# EAGLE design Allwinner V3s Dev-board (EAGLE 7.7.0)
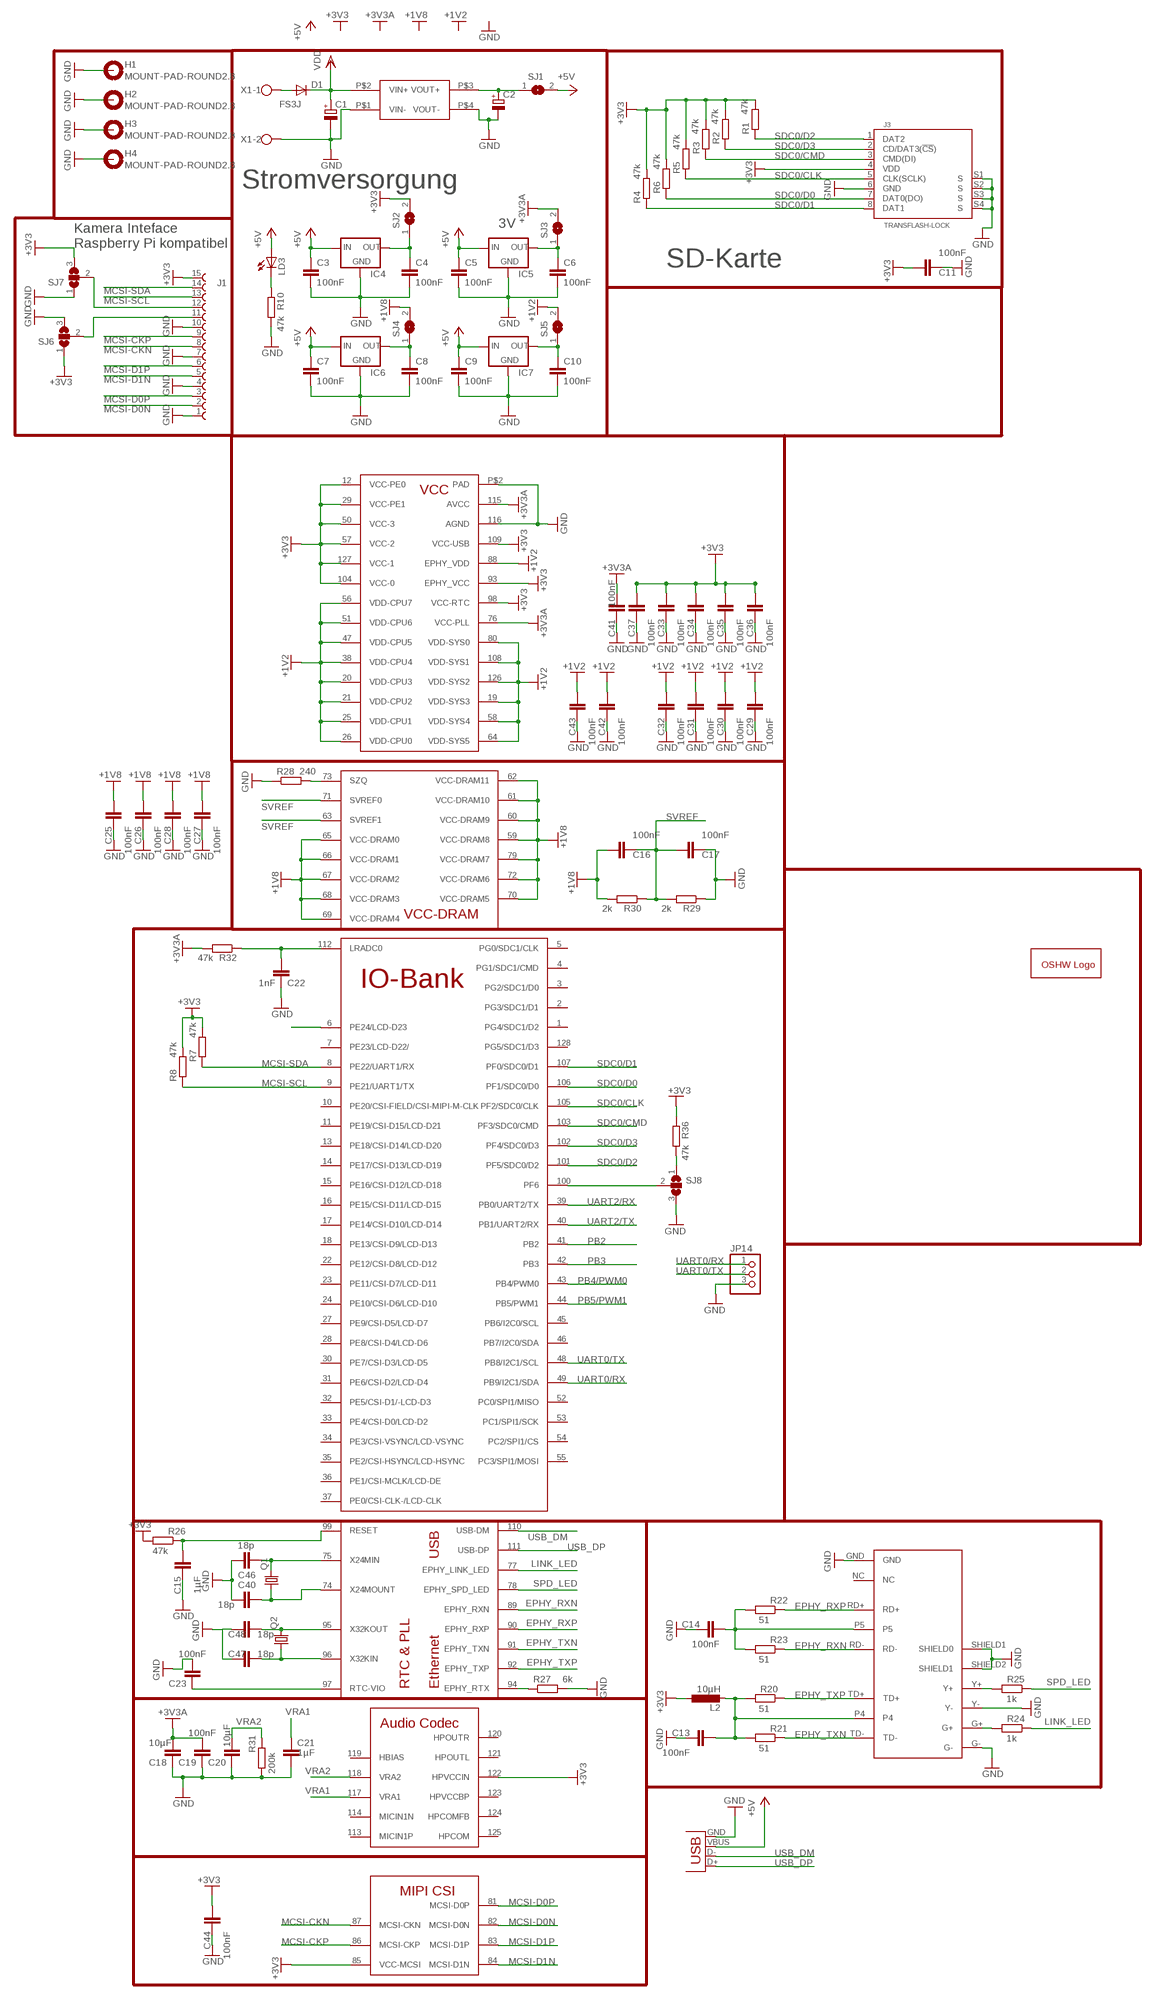
[diagram p0: schematic, sheet 1, part 1 of 2]
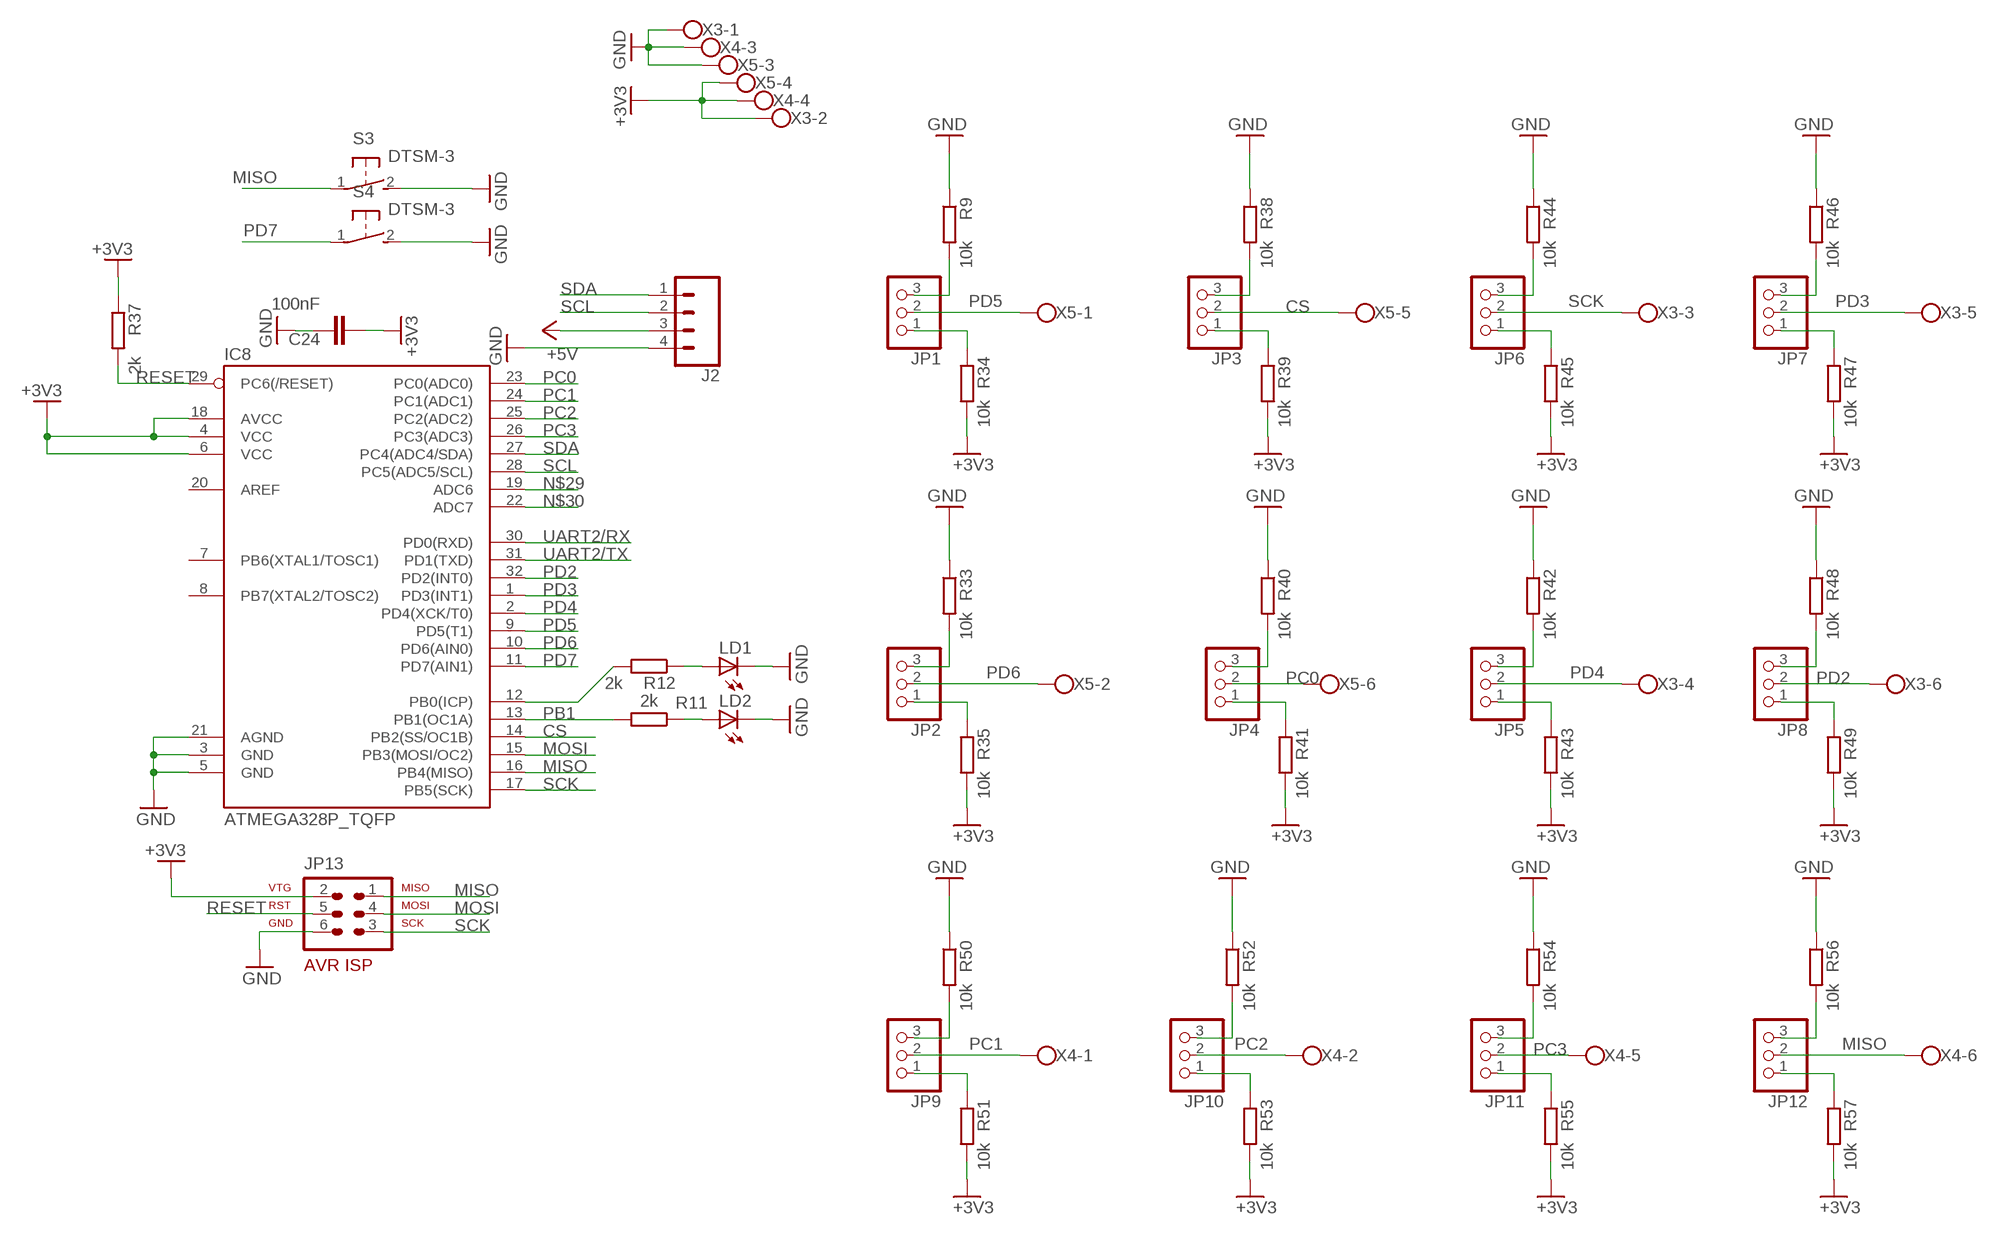
[diagram p1: schematic, sheet 1, part 2 of 2]

## Parts
C1  CPOL-EU153CLV-0807  [153CLV-0807]
C2  CPOL-EU153CLV-0807  [153CLV-0807]
C3  100nF  C-EUC0805  [C0805]
C4  100nF  C-EUC0805  [C0805]
C5  100nF  C-EUC0805  [C0805]
C6  100nF  C-EUC0805  [C0805]
C7  100nF  C-EUC0805  [C0805]
C8  100nF  C-EUC0805  [C0805]
C9  100nF  C-EUC0805  [C0805]
C10  100nF  C-EUC0805  [C0805]
C11  100nF  C-EUC0805  [C0805]
C13  100nF  C-EUC0805  [C0805]
C14  100nF  C-EUC0805  [C0805]
C15  1µF  C-EUC0805  [C0805]
C16  100nF  C-EUC0805  [C0805]
C17  100nF  C-EUC0805  [C0805]
C18  10µF  C-EUC0805  [C0805]
C19  100nF  C-EUC0805  [C0805]
C20  10µF  C-EUC0805  [C0805]
C21  1µF  C-EUC0805  [C0805]
C22  1nF  C-EUC0805  [C0805]
C23  100nF  C-EUC0805  [C0805]
C24  100nF  C-EUC0805  [C0805]
C25  100nF  C-EUC0805  [C0805]
C26  100nF  C-EUC0805  [C0805]
C27  100nF  C-EUC0805  [C0805]
C28  100nF  C-EUC0805  [C0805]
C29  100nF  C-EUC0805  [C0805]
C30  100nF  C-EUC0805  [C0805]
C31  100nF  C-EUC0805  [C0805]
C32  100nF  C-EUC0805  [C0805]
C33  100nF  C-EUC0805  [C0805]
C34  100nF  C-EUC0805  [C0805]
C35  100nF  C-EUC0805  [C0805]
C36  100nF  C-EUC0805  [C0805]
C37  100nF  C-EUC0805  [C0805]
C40  18p  C-EUC0805  [C0805]
C41  100nF  C-EUC0805  [C0805]
C42  100nF  C-EUC0805  [C0805]
C43  100nF  C-EUC0805  [C0805]
C44  100nF  C-EUC0805  [C0805]
C46  18p  C-EUC0805  [C0805]
C47  18p  C-EUC0805  [C0805]
C48  18p  C-EUC0805  [C0805]
D1  FS3J  DIODE-SMC  [SMC]
GOLD_ORB_SM2  OSHWLOGOLOGO8MM  [OSHW_8MM]
H1  MOUNT-PAD-ROUND2.8  [2,8-PAD]
H2  MOUNT-PAD-ROUND2.8  [2,8-PAD]
H3  MOUNT-PAD-ROUND2.8  [2,8-PAD]
H4  MOUNT-PAD-ROUND2.8  [2,8-PAD]
IC1  V3S  [QFP-128]
IC4  LM1117  [SOT223]
IC5  LM1117  [SOT223]
IC6  LM1117  [SOT223]
IC7  LM1117  [SOT223]
IC8  ATMEGA328P_TQFP  [TQFP32-08]
J1  68611514122  [68611514122]
J2  CONN_04SMD_LONG  [1X04_SMD_LONG]
J3  TRANSFLASH-LOCK  [TRANSFLASH-LOCK-SOCK]
JP1  PINHD-1X3  [1X03]
JP2  PINHD-1X3  [1X03]
JP3  PINHD-1X3  [1X03]
JP4  PINHD-1X3  [1X03]
JP5  PINHD-1X3  [1X03]
JP6  PINHD-1X3  [1X03]
JP7  PINHD-1X3  [1X03]
JP8  PINHD-1X3  [1X03]
JP9  PINHD-1X3  [1X03]
JP10  PINHD-1X3  [1X03]
JP11  PINHD-1X3  [1X03]
JP12  PINHD-1X3  [1X03]
JP13  AVR-ISP-6  [AVR-ISP-6]
JP14  PINHD-1X3  [1X03]
L2  10µH  L-EUL0805  [L0805]
LD1  LEDSMT1206  [1206]
LD2  LEDSMT1206  [1206]
LD3  LEDSMT1206  [1206]
M1  MP1584-MINI  [MINI-DC-BRICK]
Q1  CRYSTALHC49S  [HC49/S]
Q2  CRYSTALTC26H  [TC26H]
R1  47k  R-EU_R0805  [R0805]
R2  47k  R-EU_R0805  [R0805]
R3  47k  R-EU_R0805  [R0805]
R4  47k  R-EU_R0805  [R0805]
R5  47k  R-EU_R0805  [R0805]
R6  47k  R-EU_R0805  [R0805]
R7  47k  R-EU_R0805  [R0805]
R8  47k  R-EU_R0805  [R0805]
R9  10k  R-EU_R0805  [R0805]
R10  47k  R-EU_R0805  [R0805]
R11  2k  R-EU_R0805  [R0805]
R12  2k  R-EU_R0805  [R0805]
R20  51  R-EU_R0805  [R0805]
R21  51  R-EU_R0805  [R0805]
R22  51  R-EU_R0805  [R0805]
R23  51  R-EU_R0805  [R0805]
R24  1k  R-EU_R0805  [R0805]
R25  1k  R-EU_R0805  [R0805]
R26  47k  R-EU_R0805  [R0805]
R27  6k  R-EU_R0805  [R0805]
R28  240  R-EU_R0805  [R0805]
R29  2k  R-EU_R0805  [R0805]
R30  2k  R-EU_R0805  [R0805]
R31  200k  R-EU_R0805  [R0805]
R32  47k  R-EU_R0805  [R0805]
R33  10k  R-EU_R0805  [R0805]
R34  10k  R-EU_R0805  [R0805]
R35  10k  R-EU_R0805  [R0805]
R36  47k  R-EU_R0805  [R0805]
R37  2k  R-EU_R0805  [R0805]
R38  10k  R-EU_R0805  [R0805]
R39  10k  R-EU_R0805  [R0805]
R40  10k  R-EU_R0805  [R0805]
R41  10k  R-EU_R0805  [R0805]
R42  10k  R-EU_R0805  [R0805]
R43  10k  R-EU_R0805  [R0805]
R44  10k  R-EU_R0805  [R0805]
R45  10k  R-EU_R0805  [R0805]
R46  10k  R-EU_R0805  [R0805]
R47  10k  R-EU_R0805  [R0805]
R48  10k  R-EU_R0805  [R0805]
R49  10k  R-EU_R0805  [R0805]
R50  10k  R-EU_R0805  [R0805]
R51  10k  R-EU_R0805  [R0805]
R52  10k  R-EU_R0805  [R0805]
R53  10k  R-EU_R0805  [R0805]
R54  10k  R-EU_R0805  [R0805]
R55  10k  R-EU_R0805  [R0805]
R56  10k  R-EU_R0805  [R0805]
R57  10k  R-EU_R0805  [R0805]
S3  DTSM-3  [DTSM-3]
S4  DTSM-3  [DTSM-3]
SJ1  SJ  [SJ]
SJ2  SJ  [SJ]
SJ3  SJ  [SJ]
SJ4  SJ  [SJ]
SJ5  SJ  [SJ]
SJ6  SJ2W  [SJ_2]
SJ7  SJ2W  [SJ_2]
SJ8  SJ2W  [SJ_2]
U$3  HR911105A  [RJ45]
X1  W237-102  [W237-102]
X2  USB-A-H  [USB-A-H]
X3  W237-6  [W237-6]
X4  W237-6  [W237-6]
X5  W237-6  [W237-6]

## Nets
+1V2: C29.1 C30.1 C31.1 C32.1 C42.1 C43.1 IC1.19(VDD-SYS3) IC1.20(VDD-CPU3) IC1.21(VDD-CPU2) IC1.25(VDD-CPU1) IC1.26(VDD-CPU0) IC1.38(VDD-CPU4) IC1.47(VDD-CPU5) IC1.51(VDD-CPU6) IC1.56(VDD-CPU7) IC1.58(VDD-SYS4) IC1.64(VDD-SYS5) IC1.80(VDD-SYS0) IC1.88(EPHY_VDD) IC1.108(VDD-SYS1) IC1.126(VDD-SYS2) SJ5.2
+1V8: C16.1 C25.1 C26.1 C27.1 C28.1 IC1.59(VCC-DRAM8) IC1.60(VCC-DRAM9) IC1.61(VCC-DRAM10) IC1.62(VCC-DRAM11) IC1.65(VCC-DRAM0) IC1.66(VCC-DRAM1) IC1.67(VCC-DRAM2) IC1.68(VCC-DRAM3) IC1.69(VCC-DRAM4) IC1.70(VCC-DRAM5) IC1.72(VCC-DRAM6) IC1.79(VCC-DRAM7) R30.2 SJ4.2
+3V3: C11.1 C24.1 C33.1 C34.1 C35.1 C36.1 C37.1 C44.1 IC1.12(VCC-PE0) IC1.29(VCC-PE1) IC1.50(VCC-3) IC1.57(VCC-2) IC1.85(VCC-MCSI) IC1.93(EPHY_VCC) IC1.98(VCC-RTC) IC1.104(VCC-0) IC1.109(VCC-USB) IC1.122(HPVCCIN) IC1.127(VCC-1) IC8.4(VCC) IC8.6(VCC) IC8.18(AVCC) J1.15 J3.4(VDD) JP13.2 L2.1 R1.2 R2.2 R3.2 R4.2 R5.2 R6.2 R7.2 R8.2 R26.2 R34.2 R35.2 R36.1 R37.1 R39.2 R41.2 R43.2 R45.2 R47.2 R49.2 R51.2 R53.2 R55.2 R57.2 SJ2.2 SJ6.1 SJ7.3 X3.2 X4.4 X5.4
+3V3A: C18.1 C19.1 C41.1 IC1.76(VCC-PLL) IC1.115(AVCC) R32.2 SJ3.2
+5V: C3.1 C5.1 C7.1 C9.1 IC4.3(IN) IC5.3(IN) IC6.3(IN) IC7.3(IN) J2.3 LD3.A SJ1.2 X2.VBUS
CS: IC8.14(PB2(SS/OC1B)) JP3.2 X5.5
EPHY_RXN: IC1.89(EPHY_RXN) R23.1 U$3.RD-
EPHY_RXP: IC1.90(EPHY_RXP) R22.1 U$3.RD+
EPHY_TXN: IC1.91(EPHY_TXN) R21.1 U$3.TD-
EPHY_TXP: IC1.92(EPHY_TXP) R20.1 U$3.TD+
GND: C1.- C2.- C3.2 C4.2 C5.2 C6.2 C7.2 C8.2 C9.2 C10.2 C11.2 C13.2 C14.2 C15.2 C17.2 C18.2 C19.2 C20.2 C21.2 C22.1 C23.1 C24.2 C25.2 C26.2 C27.2 C28.2 C29.2 C30.2 C31.2 C32.2 C33.2 C34.2 C35.2 C36.2 C37.2 C40.1 C41.2 C42.2 C43.2 C44.2 C46.1 C47.1 C48.1 H1.B2,8(MOUNT) H2.B2,8(MOUNT) H3.B2,8(MOUNT) H4.B2,8(MOUNT) IC1.116(AGND) IC1.P$2(PAD) IC4.1(GND) IC5.1(GND) IC6.1(GND) IC7.1(GND) IC8.3(GND) IC8.5(GND) IC8.21(AGND) J1.1 J1.4 J1.7 J1.10 J2.4 J3.6(GND) J3.S1(S) J3.S2(S) J3.S3(S) J3.S4(S) JP13.6 JP14.3 LD1.C LD2.C M1.P$1(VIN-) M1.P$4(VOUT-) R9.1 R10.2 R27.2 R28.1 R29.1 R31.2 R33.1 R38.1 R40.1 R42.1 R44.1 R46.1 R48.1 R50.1 R52.1 R54.1 R56.1 S3.2 S4.2 SJ6.3 SJ7.1 SJ8.3 U$3.G- U$3.GND U$3.SHIELD1(SHIELD0) U$3.SHIELD2(SHIELD1) U$3.Y- X1.2 X2.GND X3.1 X4.3 X5.3
LINK_LED: IC1.77(EPHY_LINK_LED) R24.1
MCSI-CKN: IC1.87(MCSI-CKN) J1.8
MCSI-CKP: IC1.86(MCSI-CKP) J1.9
MCSI-D0N: IC1.82(MCSI-D0N) J1.2
MCSI-D0P: IC1.81(MCSI-D0P) J1.3
MCSI-D1N: IC1.84(MCSI-D1N) J1.5
MCSI-D1P: IC1.83(MCSI-D1P) J1.6
MCSI-SCL: IC1.9(PE21/UART1/TX) J1.13 R8.1
MCSI-SDA: IC1.8(PE22/UART1/RX) J1.14 R7.1
MISO: IC8.16(PB4(MISO)) JP12.2 JP13.1 S3.1 X4.6
MOSI: IC8.15(PB3(MOSI/OC2)) JP13.4
N$1: D1.A X1.1
N$2: JP2.3 R33.2
N$3: JP1.3 R9.2
N$4: C15.1 IC1.99(RESET) R26.1
N$5: LD1.A R12.1
N$6: LD3.C R10.1
N$7: JP1.1 R34.1
N$8: J1.11 SJ6.2
N$9: J1.12 SJ7.2
N$10: IC8.12(PB0(ICP)) R12.2
N$11: JP2.1 R35.1
N$12: JP3.3 R38.2
N$13: JP3.1 R39.1
N$14: JP4.3 R40.2
N$15: C2.+ M1.P$3(VOUT+) SJ1.1
N$16: JP4.1 R41.1
N$17: IC1.94(EPHY_RTX) R27.1
N$18: R24.2 U$3.G+
N$19: IC1.73(SZQ) R28.2
N$20: R25.2 U$3.Y+
N$21: C13.1 L2.2 R20.2 R21.2 U$3.P4
N$22: C14.1 R22.2 R23.2 U$3.P5
N$23: C22.2 IC1.112(LRADC0) R32.1
N$24: C23.2 IC1.97(RTC-VIO)
N$25: IC1.100(PF6) SJ8.2
N$26: IC1.6(PE24/LCD-D23)
N$27: R36.2 SJ8.1
N$28: JP5.3 R42.2
N$29: IC8.19(ADC6)
N$30: IC8.22(ADC7)
N$31: JP5.1 R43.1
N$32: JP6.3 R44.2
N$33: JP6.1 R45.1
N$34: JP7.3 R46.2
N$35: JP7.1 R47.1
N$36: JP8.3 R48.2
N$37: JP8.1 R49.1
N$38: JP9.3 R50.2
N$39: JP9.1 R51.1
N$40: JP10.3 R52.2
N$41: JP10.1 R53.1
N$42: C4.1 IC4.2(OUT) SJ2.1
N$43: C6.1 IC5.2(OUT) SJ3.1
N$44: C8.1 IC6.2(OUT) SJ4.1
N$45: C10.1 IC7.2(OUT) SJ5.1
N$46: C40.2 IC1.74(X24MOUNT) Q1.1
N$47: C46.2 IC1.75(X24MIN) Q1.2
N$48: C47.2 IC1.96(X32KIN) Q2.1
N$49: C48.2 IC1.95(X32KOUT) Q2.2
N$50: JP11.3 R54.2
N$51: JP11.1 R55.1
N$52: JP12.3 R56.2
N$53: JP12.1 R57.1
N$54: LD2.A R11.1
PB1: IC8.13(PB1(OC1A)) R11.2
PB2: IC1.41(PB2)
PB3: IC1.42(PB3)
PB4/PWM0: IC1.43(PB4/PWM0)
PB5/PWM1: IC1.44(PB5/PWM1)
PC0: IC8.23(PC0(ADC0)) JP4.2 X5.6
PC1: IC8.24(PC1(ADC1)) JP9.2 X4.1
PC2: IC8.25(PC2(ADC2)) JP10.2 X4.2
PC3: IC8.26(PC3(ADC3)) JP11.2 X4.5
PD2: IC8.32(PD2(INT0)) JP8.2 X3.6
PD3: IC8.1(PD3(INT1)) JP7.2 X3.5
PD4: IC8.2(PD4(XCK/T0)) JP5.2 X3.4
PD5: IC8.9(PD5(T1)) JP1.2 X5.1
PD6: IC8.10(PD6(AIN0)) JP2.2 X5.2
PD7: IC8.11(PD7(AIN1)) S4.1
RESET: IC8.29(PC6(/RESET)) JP13.5 R37.2
SCK: IC8.17(PB5(SCK)) JP6.2 JP13.3 X3.3
SCL: IC8.28(PC5(ADC5/SCL)) J2.2
SDA: IC8.27(PC4(ADC4/SDA)) J2.1
SDC0/CLK: IC1.105(PF2/SDC0/CLK) J3.5(CLK(SCLK)) R5.1
SDC0/CMD: IC1.103(PF3/SDC0/CMD) J3.3(CMD(DI)) R3.1
SDC0/D0: IC1.106(PF1/SDC0/D0) J3.7(DAT0(DO)) R6.1
SDC0/D1: IC1.107(PF0/SDC0/D1) J3.8(DAT1) R4.1
SDC0/D2: IC1.101(PF5/SDC0/D2) J3.1(DAT2) R1.1
SDC0/D3: IC1.102(PF4/SDC0/D3) J3.2(CD/DAT3(!CS!)) R2.1
SPD_LED: IC1.78(EPHY_SPD_LED) R25.1
SVREF: C16.2 C17.1 IC1.63(SVREF1) IC1.71(SVREF0) R29.2 R30.1
UART0/RX: IC1.49(PB9/I2C1/SDA) JP14.1
UART0/TX: IC1.48(PB8/I2C1/SCL) JP14.2
UART2/RX: IC1.39(PB0/UART2/TX) IC8.30(PD0(RXD))
UART2/TX: IC1.40(PB1/UART2/RX) IC8.31(PD1(TXD))
USB_DM: IC1.110(USB-DM) X2.D-
USB_DP: IC1.111(USB-DP) X2.D+
VDD: C1.+ D1.C M1.P$2(VIN+)
VRA1: C21.1 IC1.117(VRA1)
VRA2: C20.1 IC1.118(VRA2) R31.1
Unconnected: IC1.1(PG4/SDC1/D2) IC1.2(PG3/SDC1/D1) IC1.3(PG2/SDC1/D0) IC1.4(PG1/SDC1/CMD) IC1.5(PG0/SDC1/CLK) IC1.7(PE23/LCD-D22/) IC1.10(PE20/CSI-FIELD/CSI-MIPI-M-CLK) IC1.11(PE19/CSI-D15/LCD-D21) IC1.13(PE18/CSI-D14/LCD-D20) IC1.14(PE17/CSI-D13/LCD-D19) IC1.15(PE16/CSI-D12/LCD-D18) IC1.16(PE15/CSI-D11/LCD-D15) IC1.17(PE14/CSI-D10/LCD-D14) IC1.18(PE13/CSI-D9/LCD-D13) IC1.22(PE12/CSI-D8/LCD-D12) IC1.23(PE11/CSI-D7/LCD-D11) IC1.24(PE10/CSI-D6/LCD-D10) IC1.27(PE9/CSI-D5/LCD-D7) IC1.28(PE8/CSI-D4/LCD-D6) IC1.30(PE7/CSI-D3/LCD-D5) IC1.31(PE6/CSI-D2/LCD-D4) IC1.32(PE5/CSI-D1/-LCD-D3) IC1.33(PE4/CSI-D0/LCD-D2) IC1.34(PE3/CSI-VSYNC/LCD-VSYNC) IC1.35(PE2/CSI-HSYNC/LCD-HSYNC) IC1.36(PE1/CSI-MCLK/LCD-DE) IC1.37(PE0/CSI-CLK-/LCD-CLK) IC1.45(PB6/I2C0/SCL) IC1.46(PB7/I2C0/SDA) IC1.52(PC0/SPI1/MISO) IC1.53(PC1/SPI1/SCK) IC1.54(PC2/SPI1/CS) IC1.55(PC3/SPI1/MOSI) IC1.113(MICIN1P) IC1.114(MICIN1N) IC1.119(HBIAS) IC1.120(HPOUTR) IC1.121(HPOUTL) IC1.123(HPVCCBP) IC1.124(HPCOMFB) IC1.125(HPCOM) IC1.128(PG5/SDC1/D3) IC8.7(PB6(XTAL1/TOSC1)) IC8.8(PB7(XTAL2/TOSC2)) IC8.20(AREF) U$3.NC

## Notes on the sheet
- Stromversorgung
- 3V
- Kamera Inteface 
  Raspberry Pi kompatibel
- SD-Karte

## Library data of the parts
C1 C2 = rcl:CPOL-EU: POLARIZED CAPACITOR, European symbol
C3-C11 C13-C37 C40-C44 C46-C48 = rcl:C-EU: CAPACITOR, European symbol
D1 = diode-1:DIODE-: DIODE
GOLD_ORB_SM2 = oshw:OSHWLOGO: The OSHW logo for PCB layout
H1-H4 = holes:MOUNT-PAD-ROUND: MOUNTING PAD, round
IC1 = Allwinner V3s:V3S
IC4-IC7 = v-reg-2:LM1117
IC8 = SparkFun-IC-Microcontroller:ATMEGA328P_TQFP: Popular 328P in QFP Storefront component: ATmega328 - TQFP <https://www.sparkfun.com/products/13448> (COM-13448) Datasheet <http://www.sparkfun.com/datasheets/Components/SMD/ATMega328.pdf> SparkFun Products SparkFun RedBoard - Programmed with Arduino <https://www.sparkfun.com/products/12757> (DEV-12757) Arduino Pro Mini 328 - 5V/16MHz <https://www.sparkfun.com/products/11113> (DEV-11113) Arduino Pro Mini 328 - 3.3V/8MHz <https://www.sparkfun.com/products/11114> (DEV-11114) SparkFun OpenLog <https://www.sparkfun.com/products/13712> (DEV-13712) SparkFun MicroView - OLED Arduino Module <https://www.sparkfun.com/products/12923> (DEV-12923) SparkFun Digital Sandbox <https://www.sparkfun.com/products/12651> (DEV-12651) SparkFun PicoBoard <https://www.sparkfun.com/products/11888> (WIG-11888) Arduino Fio <https://www.sparkfun.com/products/10116> (DEV-10116) LilyPad Arduino 328 Main Board <https://www.sparkfun.com/products/13342> (DEV-13342) SparkFun RedStick <https://www.sparkfun.com/products/13741> (DEV-13741) LilyPad MP3 <https://www.sparkfun.com/products/11013> (DEV-11013) LilyPad Arduino SimpleSnap <https://www.sparkfun.com/products/10941> (DEV-10941) SparkFun Stepoko <https://www.sparkfun.com/products/13899> (ROB-13899) SparkFun Geiger Counter <https://www.sparkfun.com/products/11345> (SEN-11345) SparkFun EL Sequencer <https://www.sparkfun.com/products/12781> (COM-12781) Arduino Pro 328 - 5V/16MHz <https://www.sparkfun.com/products/10915> (DEV-10915) CryptoCape <https://www.sparkfun.com/products/12773> (DEV-12773) SparkFun IR Thermometer Evaluation Board - MLX90614 <https://www.sparkfun.com/products/10740> (SEN-10740) SparkFun RedBot Mainboard <https://www.sparkfun.com/products/12097> (ROB-12097) Arduino Pro 328 - 3.3V/8MHz <https://www.sparkfun.com/products/10914> (DEV-10914) SparkFun Block for Intel® Edison - Arduino <https://www.sparkfun.com/products/13036> (DEV-13036) SparkFun Simon Says - Surface Mount Soldering Kit <https://www.sparkfun.com/products/10935> (KIT-10935) SparkFun 7-Segment Serial Display - Red <https://www.sparkfun.com/products/11441> (COM-11441) SparkFun 7-Segment Serial Display - White <https://www.sparkfun.com/products/11629> (COM-11629) SparkFun 7-Segment Serial Display - Yellow <https://www.sparkfun.com/products/11443> (COM-11443) SparkFun 7-Segment Serial Display - Kelly Green <https://www.sparkfun.com/products/11440> (COM-11440) SparkFun 7-Segment Serial Display - Blue <https://www.sparkfun.com/products/11442> (COM-11442) SparkFun OpenSegment Serial Display - 20mm (Blue) <https://www.sparkfun.com/products/11647> (COM-11647) SparkFun OpenSegment Serial Display - 20mm (Green) <https://www.sparkfun.com/products/11646> (COM-11646) SparkFun OpenSegment Serial Display - 20mm (White) <https://www.sparkfun.com/products/11648> (COM-11648) SparkFun OpenSegment Serial Display - 20mm (Red) <https://www.sparkfun.com/products/11644> (COM-11644) SparkFun OpenSegment Serial Display - 20mm (Yellow) <https://www.sparkfun.com/products/11645> (COM-11645) SparkFun OpenSegment Shield <https://www.sparkfun.com/products/13190> (DEV-13190); PROD_ID: IC-09069
J1 = EAGLE-FPC_CONNECTOR_AND_FFC_CAB-rev16b:68611514122: WR-FPC 1.00mm SMT ZIF Horizontal Top Contact, 15 Pins=>Code : Con_FPC_ZIF_1.00_68611514122 <http://katalog.we-online.de/media/images/eican/Con_FPC_ZIF_1.00_6861xx14122_pf2.jpg> Details see: http://katalog.we-online.de/en/em/686_1xx_141_22 Created 2014-07-09, Karrer Zheng 2014 (C) Würth Elektronik
J2 = SparkFun-Connectors:CONN_04: Multi connection point. Often used as Generic Header-pin footprint for 0.1 inch spaced/style header connections On any of the 0.1 inch spaced packages, you can populate with these: Break Away Headers - Straight <https://www.sparkfun.com/products/116> (PRT-00116) Break Away Male Headers - Right Angle <https://www.sparkfun.com/products/553> (PRT-00553) Female Headers <https://www.sparkfun.com/products/115> (PRT-00115) Break Away Headers - Machine Pin <https://www.sparkfun.com/products/117> (PRT-00117) Break Away Female Headers - Swiss Machine Pin <https://www.sparkfun.com/products/743> (PRT-00743) For SCREWTERMINALS and SPRING TERMINALS visit here: Screw Terimnals on SparkFun.com <https://www.sparkfun.com/search/results?term=Screw+Terminals> (5mm/3.5mm/2.54mm spacing) This device is also useful as a general connection point to wire up your design to another part of your project. Our various solder wires solder well into these plated through hole pads. Hook-Up Wire - Assortment (Stranded, 22 AWG) <https://www.sparkfun.com/products/11375> (PRT-11375) Hook-Up Wire - Assortment (Solid Core, 22 AWG) <https://www.sparkfun.com/products/11367> (PRT-11367) View the entire wire category on our website here <https://www.sparkfun.com/categories/141> Special notes: Molex polarized connector foot print use with SKU : PRT-08231 with associated crimp pins and housings. 1MM SMD Version SKU: PRT-10208; PROD_ID: CONN-09140; SF_ID: PRT-12638
J3 = SD-Kartenhalter:TRANSFLASH: TransFlash TF Micro SD Card Socket Adapter
JP1-JP12 JP14 = pinhead:PINHD-1X3: PIN HEADER
JP13 = avr-4:AVR-ISP-6: AVR ISP-6 Serial Programming Header
L2 = rcl:L-EU: INDUCTOR, European symbol
LD1-LD3 = led:LED: LED OSRAM: - CHIPLED LG R971, LG N971, LY N971, LG Q971, LY Q971, LO R971, LY R971 LH N974, LH R974 LS Q976, LO Q976, LY Q976 LO Q996 - Hyper CHIPLED LW Q18S LB Q993, LB Q99A, LB R99A - SideLED LS A670, LO A670, LY A670, LG A670, LP A670 LB A673, LV A673, LT A673, LW A673 LH A674 LY A675 LS A676, LA A676, LO A676, LY A676, LW A676 LS A679, LY A679, LG A679 - Hyper Micro SIDELED® LS Y876, LA Y876, LO Y876, LY Y876 LT Y87S - SmartLED LW L88C, LW L88S LB L89C, LB L89S, LG L890 LS L89K, LO L89K, LY L89K LS L896, LA L896, LO L896, LY L896 - TOPLED LS T670, LO T670, LY T670, LG T670, LP T670 LSG T670, LSP T670, LSY T670, LOP T670, LYG T670 LG T671, LOG T671, LSG T671 LB T673, LV T673, LT T673, LW T673 LH T674 LS T676, LA T676, LO T676, LY T676, LB T676, LH T676, LSB T676, LW T676 LB T67C, LV T67C, LT T67C, LS T67K, LO T67K, LY T67K, LW E67C LS E67B, LA E67B, LO E67B, LY E67B, LB E67C, LV E67C, LT E67C LW T67C LS T679, LY T679, LG T679 LS T770, LO T770, LY T770, LG T770, LP T770 LB T773, LV T773, LT T773, LW T773 LH T774 LS E675, LA E675, LY E675, LS T675 LS T776, LA T776, LO T776, LY T776, LB T776 LHGB T686 LT T68C, LB T68C - Hyper Mini TOPLED® LB M676 - Mini TOPLED Santana® LG M470 LS M47K, LO M47K, LY M47K Source: http://www.osram.convergy.de/
M1 = MP1584-dc-brick:MP1584-MINI
Q1 = crystal:CRYSTAL: CRYSTAL; OC_FARNELL: 1667008; OC_NEWARK: unknown
Q2 = crystal:CRYSTAL: CRYSTAL; OC_FARNELL: unknown; OC_NEWARK: unknown
R1-R12 R20-R57 = rcl:R-EU_: RESISTOR, European symbol
S3 S4 = switch-tact:DTSM-3
SJ1-SJ5 = jumper:SJ: SMD solder JUMPER
SJ6-SJ8 = jumper:SJ2W: SMD solder JUMPER
U$3 = HR911105A:HR911105A
X1 = con-wago-500:W237-102: WAGO SCREW CLAMP
X2 = con-usb:USB: USB Connectors
X3-X5 = con-wago-500:W237-6: WAGO SCREW CLAMP

## Net classes
0 default: clearance 0.152 mm

## Board
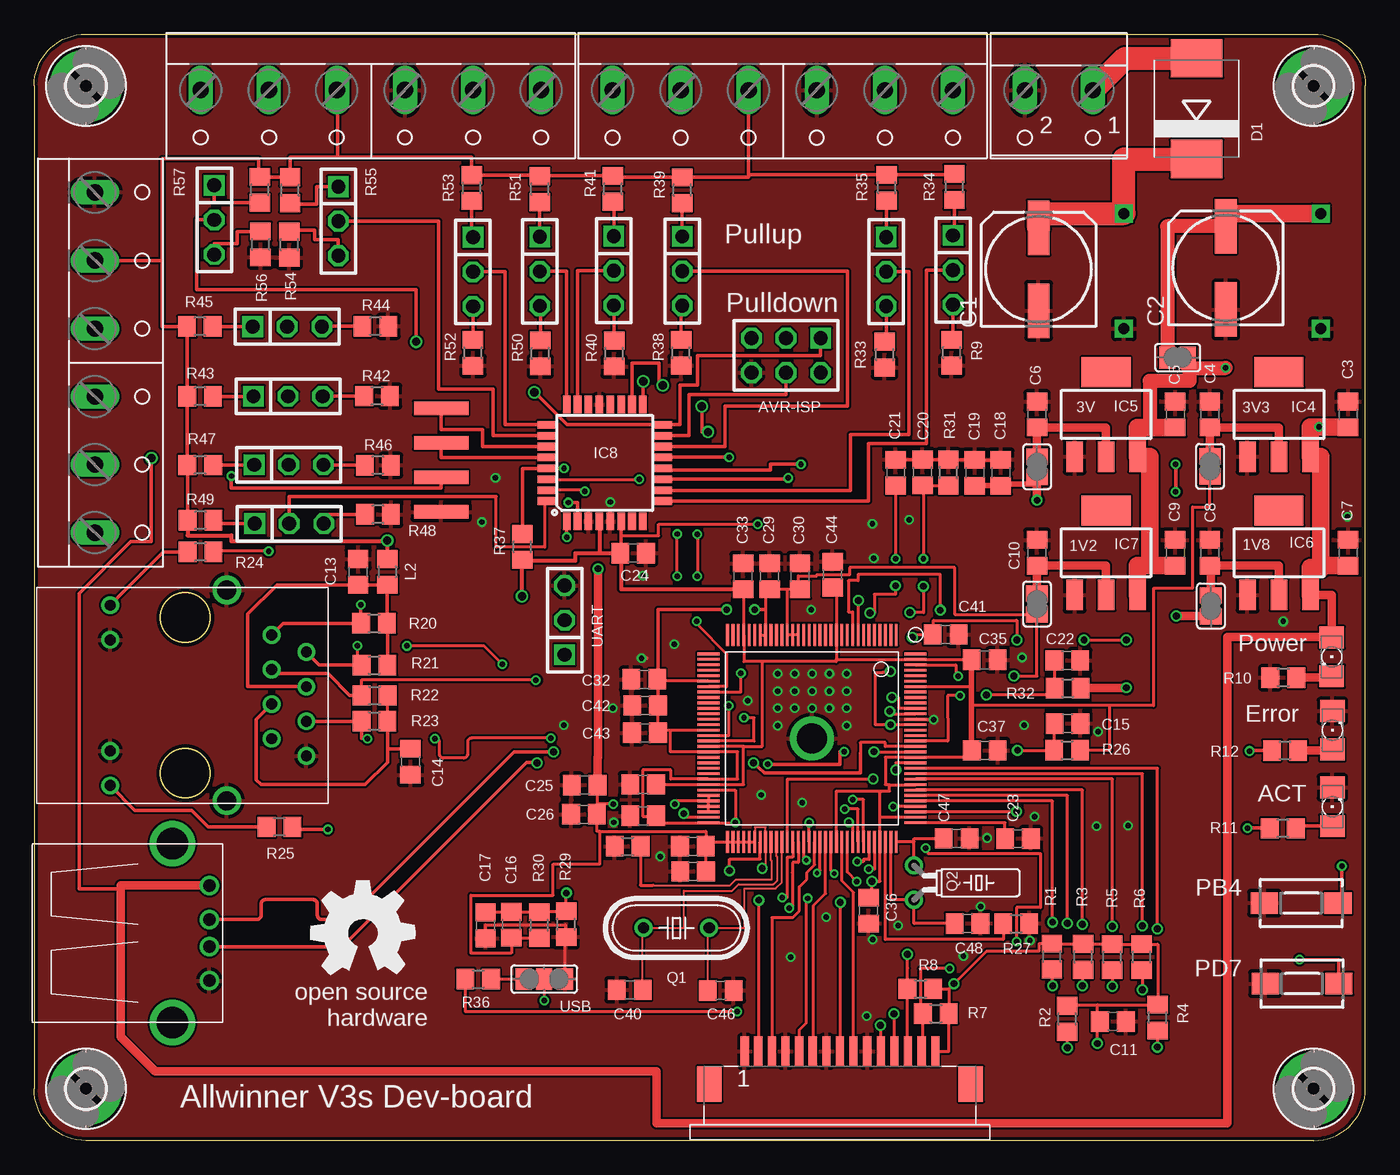
[diagram p2: board, top side]
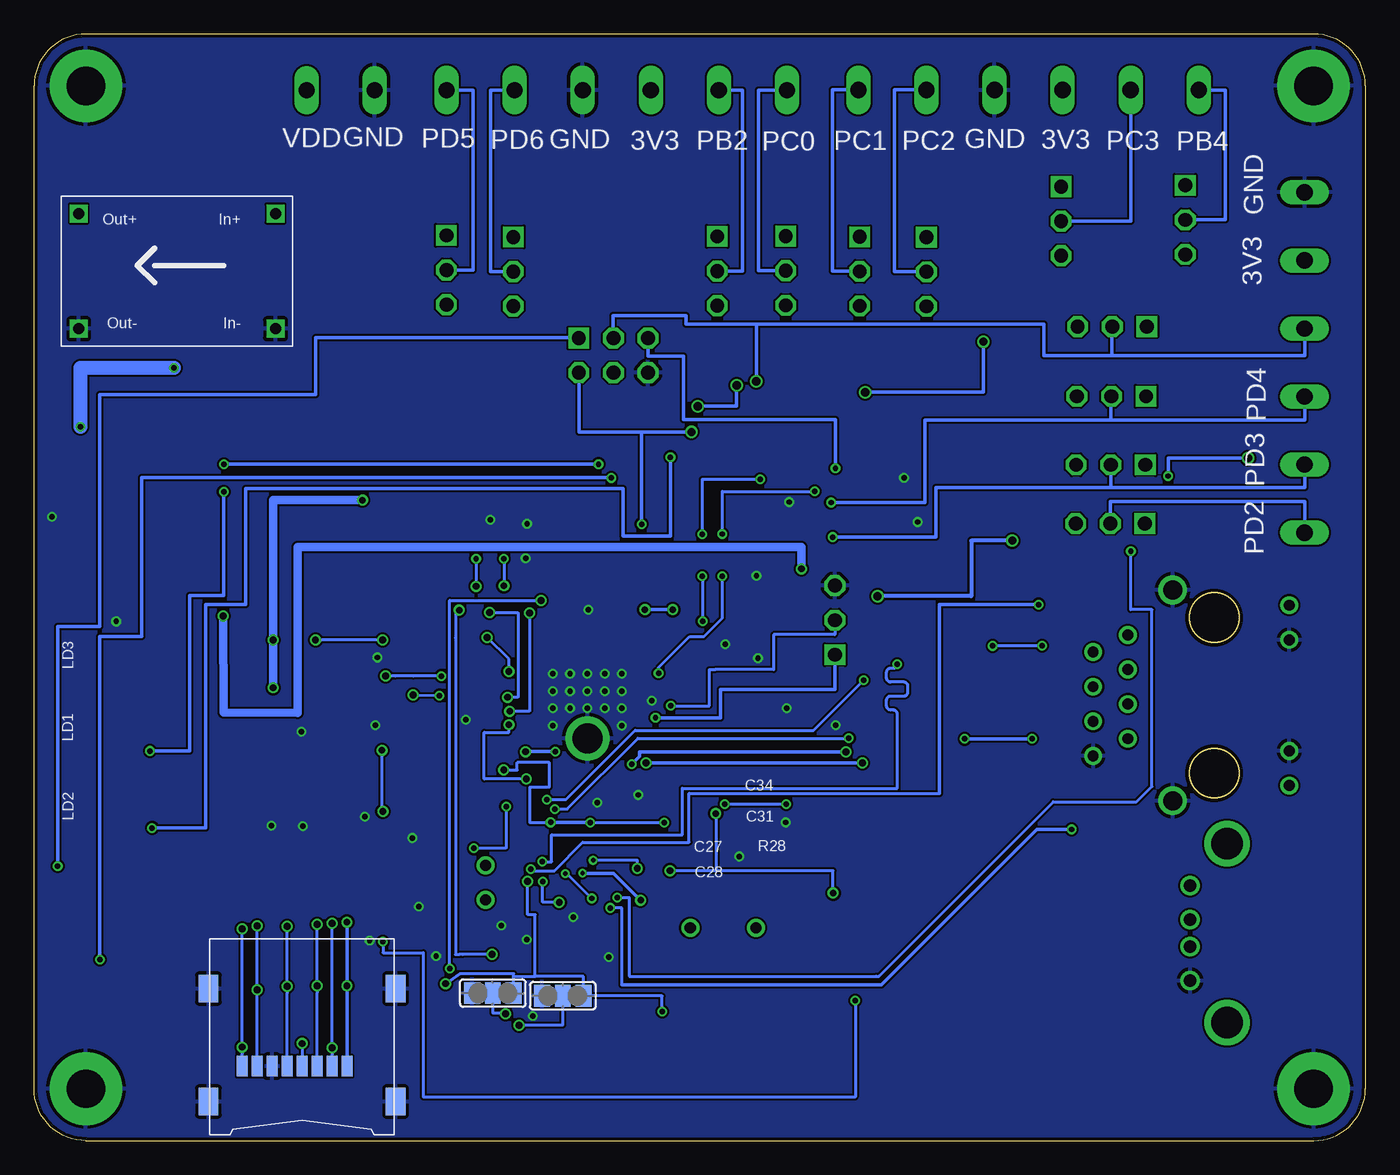
[diagram p3: board, bottom side, seen from below]

Size 97.79 x 81.28 mm. Coordinates in mm from the lower left corner, seen from the top.
Outline: 97.79,3.81 97.79,77.47 arc90 93.98,81.28 3.81,81.28 arc90 0,77.47 0,3.81 arc90 3.81,0 93.98,0 arc90 97.79,3.81
Copper layers (1*16): Top 0.035mm / dielectric 1.5mm / Bottom 0.035mm
Design rules "SeeedStudio_2layer_DRU_no_angle_20140221": minimum track width 6mil, minimum drill 12mil, track to track 6mil, track to pad 6mil, pad to pad 6mil, via to via 6mil, smd to smd 0mil, copper to edge 10mil, drill to drill 10mil, minimum pad ring 10mil, minimum via ring 6mil, stop-mask expansion 2mil, vias tented up to drill 100mil, thermal gap 10mil

### Footprints (pad centres in the part's own frame; a part is rotated, then mirrored left to right if it is on the bottom)
153CLV-0807 = smd 4 x 1.6: + 3.05,0; - -3.05,0
C0805 = smd 1.3 x 1.5: 1 -0.95,0; 2 0.95,0
SMC = smd 2.8 x 3.8: A 3.7,0; C -3.7,0
2,8-PAD = drill 2.8 pad 5.334: B2,8 0,0
QFP-128 = smd 0.2 x 1.6: 1 -6.2,-7.6; 2 -5.8,-7.6; 3 -5.4,-7.6; 4 -5,-7.6; 5 -4.6,-7.6; 6 -4.2,-7.6; 7 -3.8,-7.6; 8 -3.4,-7.6; 9 -3,-7.6; 10 -2.6,-7.6; 11 -2.2,-7.6; 12 -1.8,-7.6; 13 -1.4,-7.6; 14 -1,-7.6; 15 -0.6,-7.6; 16 -0.2,-7.6; 17 0.2,-7.6; 18 0.6,-7.6; 19 1,-7.6; 20 1.4,-7.6; 21 1.8,-7.6; 22 2.2,-7.6; 23 2.6,-7.6; 24 3,-7.6; 25 3.4,-7.6; 26 3.8,-7.6; 27 4.2,-7.6; 28 4.6,-7.6; 29 5,-7.6; 30 5.4,-7.6; 31 5.8,-7.6; 32 6.2,-7.6; 65 6.2,7.6; 66 5.8,7.6; 67 5.4,7.6; 68 5,7.6; 69 4.6,7.6; 70 4.2,7.6; 71 3.8,7.6; 72 3.4,7.6; 73 3,7.6; 74 2.6,7.6; 75 2.2,7.6; 76 1.8,7.6; 77 1.4,7.6; 78 1,7.6; 79 0.6,7.6; 80 0.2,7.6; 81 -0.2,7.6; 82 -0.6,7.6; 83 -1,7.6; 84 -1.4,7.6; 85 -1.8,7.6; 86 -2.2,7.6; 87 -2.6,7.6; 88 -3,7.6; 89 -3.4,7.6; 90 -3.8,7.6; 91 -4.2,7.6; 92 -4.6,7.6; 93 -5,7.6; 94 -5.4,7.6; 95 -5.8,7.6; 96 -6.2,7.6 | smd 1.6 x 0.2: 33 7.6,-6.2; 34 7.6,-5.8; 35 7.6,-5.4; 36 7.6,-5; 37 7.6,-4.6; 38 7.6,-4.2; 39 7.6,-3.8; 40 7.6,-3.4; 41 7.6,-3; 42 7.6,-2.6; 43 7.6,-2.2; 44 7.6,-1.8; 45 7.6,-1.4; 46 7.6,-1; 47 7.6,-0.6; 48 7.6,-0.2; 49 7.6,0.2; 50 7.6,0.6; 51 7.6,1; 52 7.6,1.4; 53 7.6,1.8; 54 7.6,2.2; 55 7.6,2.6; 56 7.6,3; 57 7.6,3.4; 58 7.6,3.8; 59 7.6,4.2; 60 7.6,4.6; 61 7.6,5; 62 7.6,5.4; 63 7.6,5.8; 64 7.6,6.2; 97 -7.6,6.2; 98 -7.6,5.8; 99 -7.6,5.4; 100 -7.6,5; 101 -7.6,4.6; 102 -7.6,4.2; 103 -7.6,3.8; 104 -7.6,3.4; 105 -7.6,3; 106 -7.6,2.6; 107 -7.6,2.2; 108 -7.6,1.8; 109 -7.6,1.4; 110 -7.6,1; 111 -7.6,0.6; 112 -7.6,0.2; 113 -7.6,-0.2; 114 -7.6,-0.6; 115 -7.6,-1; 116 -7.6,-1.4; 117 -7.6,-1.8; 118 -7.6,-2.2; 119 -7.6,-2.6; 120 -7.6,-3; 121 -7.6,-3.4; 122 -7.6,-3.8; 123 -7.6,-4.2; 124 -7.6,-4.6; 125 -7.6,-5; 126 -7.6,-5.4; 127 -7.6,-5.8; 128 -7.6,-6.2 | drill 2.2: P$2 0,0
SOT223 = smd 1.219 x 2.235: 1 -2.311,-3.099; 2 0,-3.099; 3 2.311,-3.099 | smd 3.6 x 2.2: 4 0,3.099
TQFP32-08 = smd 1.27 x 0.559: 1 -4.293,2.8; 2 -4.293,2; 3 -4.293,1.2; 4 -4.293,0.4; 5 -4.293,-0.4; 6 -4.293,-1.2; 7 -4.293,-2; 8 -4.293,-2.8; 17 4.293,-2.8; 18 4.293,-2; 19 4.293,-1.2; 20 4.293,-0.4; 21 4.293,0.4; 22 4.293,1.2; 23 4.293,2; 24 4.293,2.8 | smd 0.559 x 1.27: 9 -2.8,-4.293; 10 -2,-4.293; 11 -1.2,-4.293; 12 -0.4,-4.293; 13 0.4,-4.293; 14 1.2,-4.293; 15 2,-4.293; 16 2.8,-4.293; 25 2.8,4.293; 26 2,4.293; 27 1.2,4.293; 28 0.4,4.293; 29 -0.4,4.293; 30 -1.2,4.293; 31 -2,4.293; 32 -2.8,4.293
68611514122 = smd 0.6 x 2.2: 1 -7,2.4; 2 -6,2.4; 3 -5,2.4; 4 -4,2.4; 5 -3,2.4; 6 -2,2.4; 7 -1,2.4; 8 0,2.4; 9 1,2.4; 10 2,2.4; 11 3,2.4; 12 4,2.4; 13 5,2.4; 14 6,2.4; 15 7,2.4 | smd 1.8 x 2.6: Z1 -9.6,0; Z2 9.6,0
1X04_SMD_LONG = smd 1 x 4: 1 -3.81,5.5; 2 -1.27,5.5; 3 1.27,5.5; 4 3.81,5.5
TRANSFLASH-LOCK-SOCK = smd 0.8 x 1.5: 1 3.3,-0.46; 2 2.2,-0.46; 3 1.1,-0.46; 4 0,-0.46; 5 -1.1,-0.46; 6 -2.2,-0.46; 7 -3.3,-0.46; 8 -4.4,-0.46 | smd 1.45 x 2: S1 -6.875,-3.06; S2 -6.875,5.24; S3 6.875,5.24; S4 6.875,-3.06
1X03 = drill 1.016 square: 1 -2.54,0 | drill 1.016 octagon: 2 0,0; 3 2.54,0
AVR-ISP-6 = drill 1.016 square: 1 -2.54,-1.27 | drill 1.016 octagon: 2 -2.54,1.27; 3 0,-1.27; 4 0,1.27; 5 2.54,-1.27; 6 2.54,1.27
L0805 = smd 1.3 x 1.5: 1 -0.95,0; 2 0.95,0
1206 = smd 1.6 x 1.803: A -1.422,0; C 1.422,0
MINI-DC-BRICK = drill 0.8 square: P$1 1.27,9.73; P$2 1.27,1.27; P$3 15.73,1.27; P$4 15.73,9.73
HC49/S = drill 0.813: 1 -2.413,0; 2 2.413,0
TC26H = drill 0.813: 1 -1.27,0; 2 1.27,0
R0805 = smd 1.3 x 1.5: 1 -0.95,0; 2 0.95,0
DTSM-3 = smd 2 x 1.6: 1 -2.7,0; 2 2.7,0
SJ = smd 1.168 x 1.6: 1 -0.762,0; 2 0.762,0
SJ_2 = smd 1.168 x 1.6: 1 -1.524,0; 2 0,0; 3 1.524,0
RJ45 = drill 0.8: G+ 5.84,-6.305; G- 5.84,-3.765; GND -8.57,4.76; NC -6.03,3.5; P4 -8.57,-0.32; P5 -6.03,0.96; RD+ -6.03,-1.58; RD- -8.57,2.22; TD+ -6.03,-4.12; TD- -8.57,-2.86; Y+ 5.84,6.945; Y- 5.84,4.405 | drill 1.4: SHIELD1 -2.73,-7.425; SHIELD2 -2.73,8.065
W237-102 = drill 1.194 long: 1 -2.5,-1.27; 2 2.5,-1.27
USB-A-H = drill 0.914: D+ 2.718,-1.003; D- 2.718,1.003; GND 2.718,-3.493; VBUS 2.718,3.493 | drill 2.311: P$5 0,-6.566; P$6 0,6.566
W237-6 = drill 1.194 long: 1 -12.5,-1.27; 2 -7.5,-1.27; 3 -2.5,-1.27; 4 2.5,-1.27; 5 7.5,-1.27; 6 12.5,-1.27

### Placement (x,y rotation side)
C1  73.78,64.01 90 top
C2  87.53,64.1 90 top
C3  96.52,53.34 90 top
C4  86.36,53.34 90 top
C5  83.82,53.34 90 top
C6  73.66,53.34 90 top
C7  96.52,43.18 90 top
C8  86.36,43.18 90 top
C9  83.82,43.18 90 top
C10  73.66,43.18 90 top
C11  79.23,8.75 0 top
C13  23.8,41.77 90 top
C14  27.65,27.83 270 top
C15  75.91,30.62 0 top
C16  35.06,15.85 90 top
C17  33.16,15.81 270 top
C18  71,49.06 90 top
C19  69.1,49.05 90 top
C20  65.25,49.08 90 top
C21  63.29,49.06 90 top
C22  75.89,35.27 180 top
C23  72.27,22.18 180 top
C24  44,43.15 0 top
C25  40.44,26.11 180 top
C26  40.39,23.97 180 top
C27  48.39,21.62 180 top
C28  48.4,19.78 180 top
C29  54.02,41.45 90 top
C30  56.25,41.46 90 top
C31  44.73,23.86 180 top
C32  44.81,33.88 180 top
C33  52.08,41.45 90 top
C34  44.74,26.16 180 top
C35  69.82,35.32 0 top
C36  61.29,16.89 270 top
C37  69.83,28.66 0 top
C40  43.75,11.08 0 top
C41  66.95,37.18 0 top
C42  44.88,31.97 180 top
C43  44.87,29.95 180 top
C44  58.65,41.58 90 top
C46  50.44,11.03 180 top
C47  67.76,22.2 180 top
C48  68.56,15.95 180 top
D1  85.38,75.8 90 top
GOLD_ORB_SM2  24.13,15.24 0 top
H1  3.81,77.47 0 top
H2  3.81,3.81 0 top
H3  93.98,3.81 0 top
H4  93.98,77.47 0 top
IC1  57.13,29.55 180 top
IC4  91.44,53.34 0 top
IC5  78.74,53.34 0 top
IC6  91.44,43.18 0 top
IC7  78.74,43.18 0 top
IC8  41.92,49.78 90 top
J1  59.2,4.15 0 top
J2  24.41,49.99 270 top
J3  78.11,5.92 0 bottom
JP1  67.5,63.95 270 top
JP2  62.59,63.83 270 top
JP3  47.61,63.87 270 top
JP4  42.58,63.89 270 top
JP5  18.65,54.67 0 top
JP6  18.6,59.79 0 top
JP7  18.71,49.64 0 top
JP8  18.74,45.32 0 top
JP9  37.15,63.85 270 top
JP10  32.24,63.82 270 top
JP11  22.35,67.54 270 top
JP12  13.24,67.63 270 top
JP13  55.24,57.68 180 top
JP14  38.97,38.23 90 top
L2  25.96,41.77 270 top
LD1  95.36,30.14 90 top
LD2  95.36,24.52 90 top
LD3  95.31,35.53 270 top
M1  78.78,69.36 180 bottom
Q1  47.18,15.62 0 top
Q2  64.63,18.94 270 top
R1  74.76,13.52 90 top
R2  75.88,8.94 90 top
R3  77.05,13.5 90 top
R4  82.53,9.03 90 top
R5  79.18,13.48 90 top
R6  81.35,13.47 90 top
R7  66.24,9.34 0 top
R8  65.1,11.15 0 top
R9  67.4,57.88 90 top
R10  91.76,34 180 top
R11  91.72,22.93 180 top
R12  91.88,28.65 180 top
R20  24.97,37.99 0 top
R21  25.01,34.92 0 top
R22  25.02,32.7 0 top
R23  25,30.82 0 top
R24  12.23,43.24 180 top
R25  18.03,23.04 180 top
R26  75.87,28.68 0 top
R27  72.14,15.95 0 top
R28  43.59,21.61 0 top
R29  39.08,15.9 90 top
R30  37.1,15.84 270 top
R31  67.16,49.07 90 top
R32  75.92,33.24 0 top
R33  62.47,57.73 90 top
R34  67.6,70.05 90 top
R35  62.62,69.99 90 top
R36  32.62,11.87 0 top
R37  35.86,43.61 90 top
R38  47.53,57.87 90 top
R39  47.61,69.81 90 top
R40  42.61,57.81 90 top
R41  42.52,69.91 90 top
R42  25.19,54.69 180 top
R43  12.19,54.66 180 top
R44  25.07,59.81 180 top
R45  12.18,59.8 180 top
R46  25.25,49.6 180 top
R47  12.2,49.62 180 top
R48  25.26,46 180 top
R49  12.23,45.57 180 top
R50  37.19,57.82 90 top
R51  37.15,69.89 90 top
R52  32.24,57.87 90 top
R53  32.14,69.97 90 top
R54  18.75,65.81 90 top
R55  18.81,69.81 90 top
R56  16.64,65.83 90 top
R57  16.59,69.84 90 top
S3  93.07,17.44 180 top
S4  93.12,11.53 180 top
SJ1  83.99,57.52 0 top
SJ2  86.37,49.53 270 top
SJ3  73.67,49.5 270 top
SJ4  86.43,39.27 270 top
SJ5  73.66,39.41 270 top
SJ6  58.96,10.63 180 bottom
SJ7  64.09,10.83 0 bottom
SJ8  37.47,11.87 0 top
U$3  11.43,33.02 180 top
X1  75.27,75.88 180 top
X2  10.16,15.24 0 top
X3  5.74,57.15 270 top
X4  24.74,75.89 180 top
X5  54.99,75.89 180 top

### Tracks (layer width: path | path; a pad name or v marks a point on that pad's centre or on a via)
+1V2  (via drill 0.4, 0.5)
  Top 0.203: C43.1 46.02,30.15 | 46.02,30.15 46.75,30.15 | 46.75,30.15 IC1.47 | 46.75,30.15 46.75,28.55 IC1.51 51.68,28.56 51.68,26.55 IC1.56 46.77,26.55 46.77,27.22 44.7,27.22 44.7,23.82 45.68,23.82 C31.1 46.19,23.35 IC1.64 v51.51,23.35 51.51,25.75 IC1.58 | 46.02,30.15 45.83,30.15 C42.1 | C30.1 | C30.1 56.13,40.51 56.13,41.47 57.49,41.47 57.49,41.58 59.9,41.58 | IC1.19 IC1.20 IC1.21 55.33,40.51 | IC1.26 IC1.25 53.73,39 53.73,40.5 C29.1 | IC1.108 63.29,27.75 v63.29,27.23 | C29.1 | 45.89,33.75 arc-90 C32.1 arc90 45.89,33.75 | v67.88,34.12 67.71,34.12 67.71,34.95 IC1.126 | v71.98,34.12 73.66,34.12 SJ5.2 67.62,38.65 67.62,42.09 59.9,42.09 59.9,41.58 | 55.33,40.51 C30.1 | C29.1 55.33,40.51 | IC1.80 v56.93,23.35 | 59.9,41.58 59.92,41.58 | IC1.88 60.13,23.38 v59.85,23.38 | IC1.38 45.89,33.75
  Top 0.254: 45.83,33.88 45.83,39 v50.88,39 | v52.93,39 53.73,39 | C42.1 45.83,33.88 | 45.83,33.88 C32.1
  Bottom 0.203: v63.29,27.23 62.3,27.23 62.3,27.76 59.95,27.76 59.95,25.95 61.38,25.95 61.38,23.37 v59.85,23.37 v59.85,23.38 | v67.88,34.12 69.92,34.12 71.26,34.12 v71.98,34.12 | v51.51,23.35 arc-90 51.54,23.38 56.93,23.38 v56.93,23.35
  Bottom 0.254: 56.93,23.38 59.52,23.38 v59.85,23.38 | v50.88,39 v52.93,39
+1V8  (via drill 0.35, 0.4, 0.5)
  Top 0.152: IC1.72 53.73,23.01 52.94,23.01 IC1.70 | 53.71,21.95 IC1.72 | 41.9,26.33 41.34,25.76 | IC1.72 53.73,19.98 v53.48,19.98
  Top 0.203: IC1.70 IC1.69 IC1.68 IC1.67 IC1.66 IC1.65 49.34,21.95 C27.1 | 41.9,26.33 C25.1 | 49.53,24.94 IC1.61 IC1.62 | 49.53,24.94 IC1.60 IC1.59 | 41.34,25.76 41.34,24.73 | 41.34,24.73 C26.1 41.34,22.72 41.56,22.72 | C28.1 49.35,21.91 C27.1 | 41.56,22.72 49.34,22.72 49.34,21.91 C27.1 | R30.2 35.06,14.89 C16.1 35.06,13.76 32.09,13.76 32.09,18.03 38.13,18.03 38.13,20.31 41.56,20.31 41.56,22.72 | 49.53,24.94 47.06,24.94 v47.06,24.73 | v42.54,24.73 41.34,24.73 | IC1.79 56.53,20.59 v56.72,20.59
  Top 0.61: SJ4.2 86.43,38.53 v83.89,38.53 | C25.1 41.39,28.15 41.43,28.15 v41.43,42
  Bottom 0.203: v47.06,24.73 v42.54,24.73 | v53.48,19.98 53.48,20.59 v56.72,20.59
  Bottom 0.61: v83.89,38.53 83.86,31.44 78.44,31.4 78.44,43.6 41.43,43.6 v41.43,42
+3V3  (via drill 0.4, 0.5, 0.6)
  Top 0.203: R2.2 arc-90 75.97,9.98 78.1,9.98 | 78.1,9.98 R4.2 82.53,14.42 R6.2 R5.2 arc-90 R5.2 77.06,14.43 arc-90 R3.2 74.79,14.45 arc-90 R1.2 73.84,14.47 73.84,13.93 69.97,13.93 v67.57,11.53 67.19,11.15 | J1.15 67.19,6.55 R7.2 67.19,11.15 | R8.2 67.19,11.15 | v78.1,7.13 78.1,8.76 | 78.1,8.76 C11.1 | 78.1,8.76 78.1,9.98 | C34.1 45.7,26.15 IC1.57 52.12,26.16 52.12,28.96 | C33.1 52.13,40.51 IC1.29 52.13,35.18 53.5,35.18 | C35.1 68.87,35.35 IC1.127 58.93,35.35 | C37.1 68.37,28.15 IC1.109 62.52,28.15 62.52,26.14 62.84,26.14 | 62.84,26.14 IC1.104 | IC1.98 62.13,23.75 | 62.84,26.14 62.84,25.67 62.23,25.67 | IC1.122 68.84,33.35 68.87,33.37 | 52.12,28.96 IC1.50 | 52.13,28.95 52.12,28.96 | 58.93,35.35 IC1.12 58.93,40.62 C44.1 | 53.5,35.18 58.93,35.18 58.93,35.35 | R26.2 79.03,28.68 79.03,31.95 | 79.03,31.95 82.23,31.95 82.23,40.57 85.1,40.57 85.1,46.55 86.37,46.55 SJ2.2 | 79.03,31.95 68.87,31.95 68.87,31.73 | C36.1 61.54,17.84 v61.54,19.05 62.13,19.05 IC1.93 62.13,23.75 | 52.12,28.96 53.5,28.96 53.5,35.18 | IC1.85 58.93,25.67 62.23,25.67 | 62.13,23.75 62.13,25.57 arc-90 62.23,25.67 | R36.1 31.68,9.49 v51.65,9.49 v51.65,9.47 | 43.12,44.3 43.12,44.43 45.87,44.43 45.87,45.28 v53.17,45.28
  Top 0.254: R49.2 11.28,49.62 R47.2 11.25,54.66 R43.2 11.24,59.8 R45.2 9.43,59.8 9.43,64.65 | 52.49,70.91 52.49,70.76 R39.2 42.52,70.76 R41.2 37.15,70.86 R51.2 37.15,70.92 R53.2 32.15,72.23 22.32,72.23 | 52.49,70.91 X5.4 | R34.2 67.6,70.94 R35.2 52.52,70.94 arc90 52.49,70.91 | 9.43,64.65 9.43,72.12 16.48,72.12 16.48,70.79 R57.2 16.59,70.76 R55.2 18.81,72.23 22.32,72.23 | X3.2 9.43,64.65 | IC8.18 43.92,57.12 45.91,57.12 45.91,55.48 v46.18,55.48 | v49.05,53.94 49.05,52.05 v49.5,52.05 | IC8.6 43.12,44.3 43.12,43.22 | 22.32,72.23 22.32,77.16 X4.4
  Top 0.305: L2.1 25.96,44.07 v25.94,44.07 arc-90 25.91,44.03 14.5,44.03 14.5,44.46 11.28,44.46 R49.2 | v35.83,39.99 35.83,42.66 R37.1 35.87,42.6 39.76,42.6 39.76,43.15 41.52,43.15 | 41.52,43.15 C24.1 arc90 43.12,43.22 43.12,40.51 C33.1 | IC8.4 arc-90 IC8.4 41.52,43.15
  Top 0.406: 68.87,35.35 68.87,33.37 68.87,31.73 68.87,28.66 C37.1
  Bottom 0.203: v78.1,7.13 v78.11,7.13 J3.4 | 60.98,12.06 60.98,16.6 61.54,16.6 v61.54,19.05 | 60.98,12.06 57.43,12.06 SJ6.1 51.65,10.63 v51.65,9.47 | 62.57,12.06 60.98,12.06 | 62.57,12.06 62.57,12.26 66.53,12.26 v67.57,11.53 | SJ7.3 62.57,12.06
  Bottom 0.254: v46.18,55.48 46.18,53.94 v49.05,53.94 | v49.5,52.05 53.17,52.05 | 53.17,52.05 57.78,52.05 JP13.2 | v53.17,45.28 53.17,52.05
  Bottom 0.305: v25.94,44.07 25.94,44.06 28.95,44.06 28.95,39.99 v35.83,39.99
+3V3A  (via drill 0.5)
  Top 0.203: v64.53,36.96 64.75,37.18 C41.1 66.06,37.18 66.06,38.21 72.14,38.21 arc-90 72.18,38.17 v72.18,36.77 | IC1.76 55.33,26.55 v61.63,26.55 | IC1.115 v62.92,30.55 61.8,30.55 61.8,34.38 62.33,34.38 62.33,34.41 62.92,34.41 v62.92,34.46 | v77.12,36.77 80.21,36.77 arc-90 v80.22,36.76
  Top 0.406: C19.1 70.99,48.1 arc90 C18.1 71.11,48.23 73.67,48.23
  Top 0.61: SJ3.2 73.67,48.23 v73.67,47.04 | v80.22,33.27 76.87,33.27 R32.2
  Bottom 0.203: v62.92,34.46 62.92,35.38 64.5,36.96 v64.53,36.96 | v61.63,26.55 64.73,26.55 64.73,29.98 62.91,29.98 62.91,30.55 v62.92,30.55 | v72.18,36.77 v77.11,36.77 arc90 v77.12,36.77
  Bottom 0.61: v73.67,47.04 80.22,47.04 v80.22,36.76 v80.22,33.27
+5V  (via drill 0.4, 0.6)
  Top 0.254: J2.3 29.91,47.95 14.49,47.95 v14.49,48.81 | v8.62,50.13 8.62,44.01 7.12,44.01 3.31,40.2 3.31,18.5 6.35,18.5
  Top 0.61: X2.VBUS 6.35,18.73 6.35,18.5 6.35,7.62 8.89,5.08 45.72,5.08 45.72,1.27 87.63,1.27 87.63,36.98 95.31,36.98 LD3.A 95.31,40.08 IC6.3
  Top 1.016: 81.73,52.39 81.95,52.39 81.95,55.81 84.89,55.81 84.89,56.76 | SJ1.2 84.75,56.76 84.89,56.76 | 84.89,56.76 v87.52,56.76
  Top 1.27: C5.1 81.73,52.39 81.05,52.39 IC5.3 81.97,50.24 81.97,42.23 | C3.1 96.52,52.42 v94.38,52.42 93.75,52.42 IC4.3 94.51,50.24 94.51,42.1 | 94.51,42.1 94.51,41.99 94.74,42.23 C7.1 | IC6.3 93.75,42.1 94.51,42.1 | IC7.3 81.05,42.23 81.97,42.23 | 81.97,42.23 C9.1
  Bottom 0.254: v14.49,48.81 14.49,50.13 v8.62,50.13
  Bottom 1.016: v87.52,56.76 94.38,56.76 v94.38,52.42
CS
  Top 0.254: IC8.14 50.76,50.98 50.76,53.96 59.76,53.96 59.76,63.86 JP3.2
  Bottom 0.254: X5.5 45.76,77.16 45.76,63.86 JP3.2
EPHY_RXN  (via drill 0.4)
  Top 0.203: IC1.89 60.53,24.35 v59.55,24.35 v59.54,24.36 | v29.43,29.51 29.48,29.57 arc-90 29.78,29.27 29.78,28.4 arc90 30.07,28.1 31.55,28.1 arc90 31.85,28.4 31.85,29.27 arc-90 32.14,29.57 v37.95,29.57
  Top 0.254: U$3.RD- 24.03,30.8 R23.1 24.05,29.52 v24.48,29.52
  Bottom 0.203: v59.54,24.36 58.63,24.36 53.44,29.55 37.96,29.55 v37.95,29.57
  Bottom 0.254: v24.48,29.52 24.48,29.51 | 24.48,29.51 | 24.48,29.51 v29.43,29.51
EPHY_RXP  (via drill 0.4)
  Top 0.203: R22.1 24.07,33.87 36.81,33.87 arc-90 v36.86,33.81 | IC1.90 60.93,25.05 v60.14,25.05
  Top 0.254: U$3.RD+ 17.76,34.3 21.59,34.3 23.19,32.7 R22.1
  Bottom 0.203: v60.14,25.05 58.73,25.05 53.64,30.13 40.54,30.13 37.67,33 v36.86,33.81
EPHY_TXN  (via drill 0.4)
  Top 0.203: IC1.91 61.33,20.65 60.92,20.65 60.92,20.48 v60.46,20.48 | v34.39,34.99 33.05,36.34 v27.39,36.34 | v23.75,36.36 23.75,34.92 R21.1
  Top 0.254: R21.1 20.95,34.92 U$3.TD-
  Bottom 0.152: v60.46,20.48
  Bottom 0.203: v60.46,20.48 59.78,20.48 59.78,22.45 50.18,22.45 50.18,25.87 34.39,25.87 34.39,31.34 arc-90 34.68,31.63 34.88,31.63 arc90 35.17,31.92 35.17,32.36 arc90 34.88,32.66 33.9,32.66 arc-90 33.61,32.95 33.61,33.39 arc-90 33.9,33.68 34.88,33.68 arc90 35.17,33.97 35.17,34.41 arc90 34.88,34.7 34.68,34.7 arc-90 v34.39,34.99 | v27.39,36.34 27.37,36.36 v23.75,36.36
EPHY_TXP  (via drill 0.4)
  Top 0.203: IC1.92 61.73,19.94 v61.32,19.94
  Top 0.254: U$3.TD+ 18.31,37.99 R20.1 24,37.99 v24,39.37
  Bottom 0.203: v61.32,19.94 61.32,19.83 59.58,19.83 57.49,21.91 49.67,21.91 49.67,25.51 31.3,25.51
  Bottom 0.254: 31.3,25.51 31.3,39.37 v24,39.37
GND  (via drill 0.4)
  Top 0.203: C21.2 65.24,50.01 arc90 C20.2 R31.2 arc-90 R31.2 69.08,50.02 arc-90 C19.2 70.99,50 arc90 C18.2 | C17.2 33.16,15.85 39.03,15.85 39.03,14.95 R29.1 39,14.95 SJ8.3 | IC1.116 66.06,30.95 arc-90 v66.09,30.93
  Top 0.305: 44.95,35.44 v44.62,35.44
  other vias: 78.03,23.11 80.35,23.13 57.08,38.98 61.69,42.77 64.29,45.59 61.58,45.3 72.56,35.49 72.71,30.51 78.16,30.04 73.48,23.8 61.6,14.75 42.59,23.37 38.9,30.5 45.99,20.87 91.75,38.13 96.47,45.83 54.61,34.29 55.88,34.29 57.15,34.29 58.42,34.29 59.69,34.29 59.69,33.02 59.69,31.75 59.69,30.48 58.42,31.75 58.42,33.02 57.15,33.02 57.15,31.75 55.88,33.02 55.88,31.75 54.61,33.02 54.61,31.75 54.61,30.48 61.15,9.14 68.26,13.56 73.14,14.69 69.51,17.18 69.99,22.23 58.19,16.42 55.58,13.47 63.46,15.79 42.52,31.78 32.89,45.44 33.9,48.68 42.31,46.91 44.73,41.48 47.01,36.46 52.42,32.32 53.41,25.39 56.42,24.83
  pour Top: 0,77.47 arc-90 3.81,81.28 93.98,81.28 arc-90 97.79,77.47 97.79,3.81 arc-90 93.98,0 3.81,0 arc-106 0,5.08
  pour Bottom: 0,77.47 0,3.81 arc90 3.81,0 93.98,0 arc90 97.79,3.81 97.79,77.47 arc90 93.98,81.28 3.81,81.28 arc90
LINK_LED  (via drill 0.4)
  Top 0.203: IC1.77 55.73,20.82 55.3,20.82 55.3,17.85 v54.95,17.85 | v17.23,43.29 13.18,43.29 R24.1
  Bottom 0.203: v54.95,17.85 54.08,17.85 54.08,12.07 35.92,12.07 | 35.92,12.07 | 35.92,12.07 35.75,12.07 22.93,24.88 16.81,24.88 15.68,26.01 15.68,38.99 17.23,38.99 v17.23,43.29
MCSI-CKN  (via drill 0.4, 0.5)
  Top 0.203: J1.8 59.21,6.57 v59.21,17.5 | IC1.87 59.73,19.73 v60.43,19.02
  Bottom 0.203: v59.21,17.5 60.43,17.5 v60.43,19.02
MCSI-CKP
  Top 0.203: J1.9 60.19,18.23 59.33,19.09 IC1.86
MCSI-D0N  (via drill 0.31, 0.5)
  Top 0.203: J1.2 53.23,6.59 v53.23,17.66 | v57.51,19.64 57.73,19.87 IC1.82
  Bottom 0.254: v53.23,17.66 55.22,19.64 v57.51,19.64
MCSI-D0P
  Top 0.203: J1.3 54.2,16.38 55.7,16.38 56.2,16.88 56.2,18.65 56.76,19.2 56.76,19.7 57.33,20.27 IC1.81
MCSI-D1N  (via drill 0.31, 0.4)
  Top 0.203: 56.28,6.64 J1.5 56.2,8.12 56.68,8.6 56.7,8.6 56.7,17.62 56.83,17.62 v56.83,17.79 | v58.76,19.6 58.53,19.84 IC1.84
  Bottom 0.203: v56.83,17.79 58.64,19.6 v58.76,19.6
MCSI-D1P
  Top 0.203: J1.6 57.23,6.58 57.23,17.25 58.13,18.15 IC1.83
MCSI-SCL  (via drill 0.5)
  Top 0.203: J1.13 64.15,6.6 R8.1 64.15,12.66 | 64.15,12.66 | 64.15,12.66 v64.15,13.67 v64.14,13.67 | IC1.9 60.13,38.84 59.81,38.84 59.81,41.14 60.52,41.14 60.52,41.59 66.56,41.59 v66.56,38.96
  Bottom 0.203: v64.14,13.67 66.28,13.67 66.56,13.67 66.83,13.67 66.83,36.94 66.83,38.96 v66.56,38.96
MCSI-SDA  (via drill 0.4, 0.5)
  Top 0.203: J1.14 65.29,6.64 R7.1 | R7.1 arc-90 65.12,9.51 | v60.56,39.68 arc90 60.53,39.65 IC1.8 | v67.26,12.64 65.1,12.64 65.1,9.52 R7.1
  Bottom 0.203: v67.26,12.64 67.26,39.68 v60.56,39.68
MISO  (via drill 0.4, 0.6)
  Top 0.254: v36.75,54.96 39.13,52.58 39.18,52.58 IC8.16 47.44,52.58 47.44,55.48 48.73,55.48 48.73,57.66 57.78,57.66 JP13.1 | v28.06,58.68 28.06,62.52 11.96,62.52 11.96,67.63 JP12.2 | v96.05,20.15 96.05,17.44 S3.1
  Bottom 0.254: v36.75,54.96 28.06,54.96 v28.06,58.68 | JP12.2 10.31,67.63 10.31,77.16 X4.6 | v96.05,20.15 96.05,37.78 92.97,37.78 92.97,54.81 77.12,54.81 77.12,58.98 58.16,58.98 57.78,58.98 JP13.1
MOSI
  Top 0.254: IC8.15 48.1,51.78 48.1,54.79 55.24,54.79 JP13.4
N$1
  Top 1.676: X1.1 80.12,79.5 D1.A
N$2
  Top 0.254: R33.2 62.59,58.68 JP2.3
N$3
  Top 0.254: R9.2 67.5,58.83 JP1.3
N$4  (via drill 0.5)
  Top 0.203: v72.24,28.67 R26.1 74.92,30.62 C15.1 | IC1.99 arc-90 64.75,24.17 v72.17,24.17
  Bottom 0.203: v72.17,24.17 72.24,24.17 v72.24,28.67
N$5
  Top 0.61: R12.1 95.36,28.65 LD1.A
N$6
  Top 0.61: R10.1 95.31,34 LD3.C
N$7
  Top 0.254: JP1.1 67.6,66.49 R34.1
N$8  (via drill 0.5)
  Top 0.203: v62.16,8.48 62.16,6.55 J1.11
  Bottom 0.203: SJ6.2 58.96,8.48 v62.16,8.48
N$9  (via drill 0.5)
  Top 0.203: v63.17,9.31 63.17,6.55 J1.12
  Bottom 0.203: v63.17,9.31 63.17,9.35 64.08,9.35 64.08,10.83 SJ7.2
N$10  (via drill 0.4)
  Top 0.254: IC8.12 arc90 46.34,49.25 54.09,49.25 54.09,49.69 v56.33,49.69 | v83.85,49.67 83.85,47.66 v83.86,47.66 | v89.27,28.62 89.27,28.65 R12.2
  Bottom 0.254: v56.33,49.69 v83.85,49.69 v83.85,49.67 | v83.86,47.66 83.86,40.05 86.36,40.05 86.36,28.62 v89.27,28.62
N$11
  Top 0.254: JP2.1 62.62,66.37 R35.1
N$12
  Top 0.254: R38.2 47.52,61.33 JP3.3
N$13
  Top 0.254: JP3.1 R39.1
N$14
  Top 0.254: JP4.3 42.58,58.76 R40.2
N$15
  Top 1.016: C2.+ 83.23,67.15 SJ1.1
  Top 1.27: C2.+ 87.53,68.09 M1.P$3
N$16
  Top 0.254: JP4.1 42.58,68.97 R41.1
N$17
  Top 0.203: R27.1 71.19,14.77 62.53,14.77 IC1.94
N$18
  Top 0.254: U$3.G+ 9.5,43.24 R24.2
N$19
  Top 0.152: 45.48,18.75 51.13,18.75 51.55,19.17 54.19,19.17 54.19,20.56 54.13,20.56 IC1.73
  Top 0.203: R28.2 44.54,18.75 45.48,18.75
N$20
  Top 0.254: U$3.Y+ 7.41,24.26 11.56,24.26 12.78,23.04 R25.2
N$21
  Top 0.254: R21.2 25.96,37.96 R20.2 25.93,40.79 L2.2 C13.1 17.84,40.82 15.69,38.66 15.69,33.34 U$3.P4
N$22
  Top 0.203: R23.2 25.95,32.7 R22.2
  Top 0.254: C14.1 25.95,28.78 | 25.95,28.78 R23.2 | U$3.P5 16.32,30.92 16.32,26.51 16.69,26.14 24.32,26.14 25.95,27.78 25.95,28.78
N$23  (via drill 0.4, 0.5)
  Top 0.203: C22.2 arc-90 74.97,35.24 R32.1 74.97,33.06 arc-90 74.65,32.74 v69.96,32.74 | v68.01,32.69 67.1,32.69 67.11,29.37 67.09,29.35 IC1.112
  Bottom 0.203: v69.96,32.74 arc90 v69.95,32.74 v68.01,32.69
N$24
  Top 0.203: C23.2 71.32,23.35 IC1.97
N$25  (via drill 0.4)
  Top 0.203: IC1.100 v63.11,24.55 v63.11,24.54 | v65.48,21.47 65.66,21.09 73.92,21.09 73.92,17.12 72.16,17.12 v72.16,14.6 | SJ8.2 v37.47,10.28
  Bottom 0.203: v63.11,24.54 63.13,24.54 63.13,21.47 v65.48,21.47 | v72.16,14.6 72.16,13.8 69.21,13.8 69.21,3.22 37.47,3.22 v37.47,10.28
N$27
  Top 0.203: R36.2 SJ8.1
N$28
  Top 0.254: JP5.3 21.19,54.69 R42.2
N$31
  Top 0.254: R43.1 JP5.1
N$32
  Top 0.254: JP6.3 21.14,59.81 R44.2
N$33
  Top 0.254: R45.1 JP6.1
N$34
  Top 0.254: JP7.3 21.25,49.6 R46.2
N$35
  Top 0.254: R47.1 13.15,49.64 JP7.1
N$36
  Top 0.254: JP8.3 21.28,46 R48.2
N$37
  Top 0.254: R49.1 13.43,45.32 JP8.1
N$38
  Top 0.254: R50.2 37.19,61.31 JP9.3
N$39
  Top 0.254: JP9.1 R51.1
N$40
  Top 0.254: JP10.3 R52.2
N$41
  Top 0.254: JP10.1 32.15,66.36 R53.1
N$42
  Top 0.61: IC4.2 91.44,52.39 C4.1 SJ2.1
N$43
  Top 0.61: IC5.2 78.74,52.39 C6.1 SJ3.1
N$44
  Top 0.61: IC6.2 91.44,42.23 C8.1 86.43,42.23 SJ4.1
N$45
  Top 0.61: IC7.2 78.74,42.23 C10.1 SJ5.1
N$46
  Top 0.152: IC1.74 | C40.2 44.7,15.55 Q1.1 47.73,15.62 47.73,18.36 51.27,18.36 51.75,18.84 54.3,18.84 54.59,19.12 54.59,20.84 54.53,20.91 IC1.74
N$47
  Top 0.152: C46.2 49.49,15.52 Q1.2 52.18,15.62 52.18,18.52 54.47,18.52 54.93,18.98 IC1.75
N$48
  Top 0.203: IC1.96 64.63,21.95 Q2.1 64.63,22.2 C47.2
N$49
  Top 0.203: C48.2 64.63,15.95 Q2.2 62.93,17.67 IC1.95
N$50
  Top 0.254: R54.2 18.75,66.89 20.6,66.89 20.6,66.17 22.35,66.17 JP11.3
N$51
  Top 0.254: R55.1 18.81,68.78 20.76,68.78 20.76,70.08 JP11.1
N$52
  Top 0.254: JP12.3 13.24,65.87 14.93,65.87 14.93,66.78 R56.2
N$53
  Top 0.254: JP12.1 13.24,68.89 R57.1
N$54
  Top 0.254: R11.1 92.67,23.1 LD2.A
PB1  (via drill 0.4)
  Top 0.254: R11.2 90.77,22.96 v89.11,22.96 | v51.05,50.2 46.21,50.2 IC8.13
  Bottom 0.254: v89.11,22.96 85.17,22.96 85.17,39.36 82.24,39.36 82.24,47.91 54.54,47.91 54.54,44.4 51.05,44.4 v51.05,50.2
PC0
  Top 0.254: IC8.23 39.92,63.89 JP4.2
  Bottom 0.254: JP4.2 44.59,63.89 44.59,77.16 X5.6
PC1
  Top 0.254: IC8.24 39.12,63.85 JP9.2
  Bottom 0.254: JP9.2 39.13,63.85 39.13,77.2 37.24,77.2 X4.1
PC2
  Top 0.254: IC8.25 34.59,52.58 34.59,63.82 JP10.2
  Bottom 0.254: JP10.2 34.59,63.82 34.59,77.17 32.24,77.17 X4.2
PC3
  Top 0.254: IC8.26 33.72,51.78 33.72,55.2 29.7,55.2 29.7,67.54 JP11.2
  Bottom 0.254: 17.28,77.16 X4.5 17.24,67.54 JP11.2
PD2
  Top 0.203: 37.5,46.98 37.51,43.6 33.95,43.6 33.94,47.32
  Top 0.254: IC8.32 37.5,46.98 | 33.94,47.32 18.75,47.32 18.75,46.94 18.74,46.94 JP8.2
  Bottom 0.254: X3.6 4.47,46.94 18.75,46.94 JP8.2
PD3  (via drill 0.4)
  Top 0.254: IC8.1 39.12,44.33 v39.12,44.33
  Bottom 0.254: JP7.2 18.71,48.22 18.71,47.99 | 18.71,47.99 18.71,47.98 4.46,47.98 4.46,49.65 X3.5 | v39.12,44.33 31.57,44.33 31.57,47.99 18.71,47.99
PD4  (via drill 0.4)
  Top 0.254: IC8.2 39.92,46.87 v39.25,46.87
  Bottom 0.254: X3.4 4.47,52.91 18.68,52.91 | 18.68,52.91 18.68,54.67 JP5.2 | v39.25,46.87 32.35,46.87 32.35,52.91 18.68,52.91
PD5
  Top 0.254: IC8.9 61.29,46.98 61.29,51.19 65.53,51.19 65.53,63.95 JP1.2
  Bottom 0.254: JP1.2 65.53,63.95 65.53,77.16 X5.1
PD6
  Top 0.254: IC8.10 46.25,47.78 46.25,47.75 59.98,47.75 59.98,51.88 64.27,51.88 64.27,63.83 JP2.2
  Bottom 0.254: X5.2 64.27,77.16 64.27,63.83 JP2.2
PD7  (via drill 0.4)
  Top 0.254: S4.1 95.82,13.29 v92.95,13.29 | v55.4,48.67 arc-90 55.31,48.58 IC8.11
  Bottom 0.254: v92.95,13.29 92.95,37.03 89.87,37.03 89.87,48.69 55.4,48.69 v55.4,48.67
RESET  (via drill 0.4)
  Top 0.254: v38.93,49.38 IC8.29 35.87,49.38 R37.2
  Bottom 0.254: JP13.5 52.7,57.63 50.08,57.63 50.08,52.97 38.91,52.97 38.91,49.38 v38.93,49.38
SCK  (via drill 0.6)
  Top 0.254: IC8.17 44.74,54.07 v44.74,55.77
  Bottom 0.254: v44.74,55.77 44.74,59.97 | JP13.3 55.25,60.61 49.91,60.61 49.91,59.97 44.74,59.97 | X3.3 4.47,57.66 18.61,57.66 | 18.61,57.66 18.61,59.79 JP6.2 | 44.74,59.97 23.62,59.97 23.62,57.65 18.61,57.65 18.61,57.66
SCL
  Top 0.254: J2.2 29.91,50.18 IC8.28
SDA
  Top 0.254: J2.1 29.91,52.22 32.93,52.22 32.93,50.98 IC8.27
SDC0/CLK  (via drill 0.5)
  Top 0.203: v79.21,15.73 79.21,26.55 IC1.105 | R5.1 arc-90 79.21,12.5 v79.21,11.34
  Bottom 0.203: J3.5 79.21,10.83 v79.21,11.34 v79.21,15.73
SDC0/CMD  (via drill 0.5)
  Top 0.203: v77,15.88 77,25.75 IC1.103 | R3.1 arc90 77.01,12.5 v77.01,11.36
  Bottom 0.203: J3.3 77.01,10.84 v77.01,11.36 v77.01,15.88 v77,15.88
SDC0/D0  (via drill 0.5)
  Top 0.203: v81.41,15.76 81.42,26.95 IC1.106 | R6.1 arc-90 81.41,12.47 v81.41,11.08
  Bottom 0.203: J3.7 v81.41,11.08 81.41,15.62 v81.41,15.76
SDC0/D1  (via drill 0.5)
  Top 0.203: v82.51,15.55 82.51,27.35 IC1.107 | R4.1 arc90 82.51,8.06 v82.51,6.87
  Bottom 0.203: J3.8 82.51,6.34 v82.51,6.87 v82.51,15.55
SDC0/D2  (via drill 0.5)
  Top 0.203: v74.81,16.05 74.81,24.95 IC1.101 | R1.1 74.76,11.38 v74.81,11.38
  Bottom 0.254: J3.1 74.81,10.86 v74.81,11.38 v74.81,16.05
SDC0/D3  (via drill 0.5)
  Top 0.203: v75.9,15.95 75.9,25.35 IC1.102 | R2.1 75.88,6.83 v75.91,6.83
  Bottom 0.203: J3.2 75.91,6.32 v75.91,6.83 v75.91,15.95 v75.9,15.95
SPD_LED  (via drill 0.4)
  Top 0.203: IC1.78 56.13,20.43 55.71,20.43 55.71,19.7 | 55.71,19.7 55.7,19.7 | 55.71,19.7 55.71,17.09 v55.46,17.09
  Top 0.254: R25.1 18.98,22.86 v21.59,22.86
  Bottom 0.203: 54.61,11.43 54.61,17.09 v55.46,17.09
  Bottom 0.254: v21.59,22.86 24.13,22.86 35.56,11.43 54.61,11.43
SVREF  (via drill 0.5)
  Top 0.203: C17.1 33.16,16.8 C16.2 35.06,16.79 R30.1 37.1,16.85 R29.2 39.08,18.18 v39.09,18.18 | v51.08,19.83 51.08,20.68 53.31,20.68 arc90 53.33,20.7 IC1.71 | IC1.63 47.72,23.75 v47.72,24.02
  Bottom 0.203: v39.09,18.18 39.09,19.83 47.71,19.83 | 47.71,19.83 v51.08,19.83 | v47.72,24.02 47.71,24.02 47.71,19.83
UART0/RX  (via drill 0.4)
  Top 0.203: IC1.49 52.88,29.35 52.88,31.06 v52.14,31.06
  Bottom 0.254: JP14.1 38.97,33.13 47.36,33.13 47.36,31.06 51.29,31.06 v52.14,31.06
UART0/TX  (via drill 0.4)
  Top 0.203: IC1.48 51.03,29.75 v51.03,31.94
  Bottom 0.203: JP14.2 38.97,37.16 43.47,37.16 43.47,34.59 47.77,34.59 48.18,34.59 48.18,31.94 v51.03,31.94
UART2/RX  (via drill 0.4)
  Top 0.203: IC8.30 37.63,48.57 v44.46,48.57 | 48.72,41.45 v48.7,41.45 48.71,41.45 v48.71,44.54 | v48.69,38.15 48.69,37.94 50.88,35.75 50.88,33.35 IC1.39
  Bottom 0.203: v44.46,48.57 48.72,48.57 48.72,44.62 v48.71,44.54 | v48.7,41.45 48.7,38.15 v48.69,38.15
UART2/TX  (via drill 0.4)
  Top 0.203: IC1.40 51.92,32.95 v51.92,34.32 | v47.24,41.46 v47.24,44.55 | v40.46,47.69 40.46,47.78 IC8.31
  Bottom 0.203: v51.92,34.32 51.92,34.75 49.64,37.03 48.59,37.03 47.24,38.38 v47.24,41.46 | v47.24,44.55 47.24,47.69 v40.46,47.69
USB_DM  (via drill 0.4, 0.5)
  Top 0.203: v61.69,28.56 61.7,28.55 IC1.110
  Top 0.254: X2.D- 16.36,16.24 arc90 16.68,16.56 16.68,17.39 arc-90 17,17.71 20.49,17.71 arc-90 20.81,17.39 20.81,16.56 arc90 21.12,16.24 22.96,16.24 35.26,28.54 v38.16,28.54 v38.16,28.55 | v53.9,27.65 59.18,27.65 59.18,28.58 v59.5,28.58
  Bottom 0.254: v38.16,28.55 53.33,28.55 53.33,28.22 v53.9,27.65 | v61.69,28.56 61.68,28.57 v59.5,28.57 v59.5,28.58
USB_DP  (via drill 0.5)
  Top 0.203: IC1.111 62.52,28.95 62.52,29.24 60.68,29.24 60.68,28.49
  Top 0.254: X2.D+ 22.64,14.24 36.17,27.76 36.94,27.76 v36.95,27.75 | 60.68,28.49 60.68,26.99 53.65,26.99 v52.83,27.75
  Bottom 0.254: v36.95,27.75 v52.83,27.75
VDD
  Top 1.676: 85.73,72.47 85.73,71.59 85.38,71.59 D1.C 80.06,72.1 M1.P$2 73.78,68.09 C1.+
VRA1  (via drill 0.4, 0.5)
  Top 0.203: C21.1 v63.28,42.73 | v63.28,40.75 63.28,40.12 61.71,40.12 61.71,38.75 v61.4,38.75 | v62.85,31.54 62.85,31.35 IC1.117
  Bottom 0.203: v63.28,42.73 v63.28,40.75 | v61.4,38.75 v61.41,38.75 61.41,31.53 v62.85,31.53 v62.85,31.54
VRA2  (via drill 0.4, 0.5)
  Top 0.203: R31.1 arc90 R31.1 C20.1 65.32,48.07 65.32,42.92 v65.32,42.75 | v65.33,40.72 65.33,38.78 v64.33,38.78 | IC1.118 63.51,31.75 63.51,32.55 v63,32.55 v63,32.56
  Bottom 0.203: v65.32,42.75 v65.33,42.75 v65.33,40.72 | v64.33,38.78 62.25,38.78 62.25,32.56 62.61,32.56 v63,32.56

### Text on the board
tNames: Pullup | Pulldown | AVR-ISP | 3V | 3V3 | IC8 | 1V2 | 1V8 | UART | Power | Error | ACT | PB4 | PD7 | USB | Allwinner V3s Dev-board
bNames: PB4 | PC3 | 3V3 | GND | PC2 | PC1 | PC0 | PB2 | 3V3 | GND | PD6 | PD5 | GND | VDD | GND | 3V3 | PD4 | PD3 | PD2